# Altium project AML166-Core Rev.D.PrjPcb
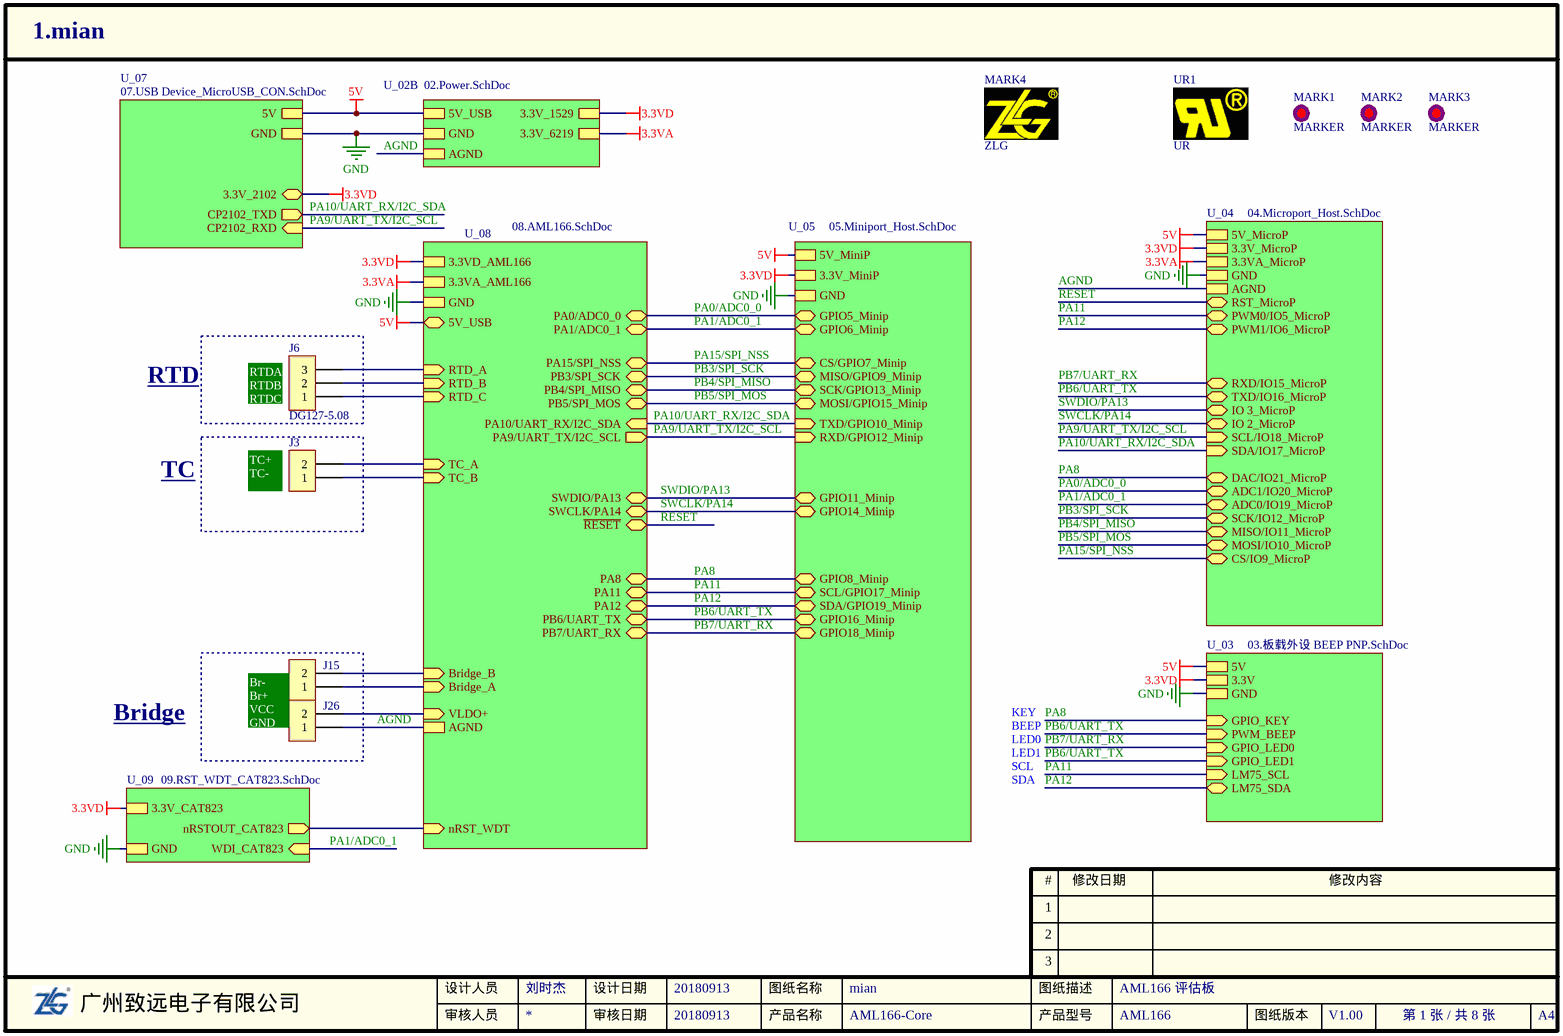
[diagram p0: 01.mian.SchDoc]
8 sheets, 138 parts. Net scope: hierarchical (ports join the sheet entries above them; power ports are global).
Sheets:
  01.mian.SchDoc
    U_08 = 08.AML166.SchDoc
    U_05 = 05.Miniport_Host.SchDoc
    U_04 = 04.Microport_Host.SchDoc
    U_03 = 03.板载外设 BEEP PNP.SchDoc
    U_02B = 02.Power.SchDoc
    U_09 = 09.RST_WDT_CAT823.SchDoc
    U_07 = 07.USB Device_MicroUSB_CON.SchDoc

## Sheet 01.mian.SchDoc
size A4; Author: 刘时杰; CompanyName: 广州致远电子有限公司; DocumentNumber: 1; SheetNumber: 1; SheetTotal: 8; PageSetup: Record=PageOptions|CenterHorizontal=True|CenterVertical=True|PrintScale=1.00|XCorrection=1.00|YCorrection=1.00|PrintKind=0|BorderSize=5000000|LeftOffset=0|BottomOffset=0|Orientation=2|PaperLength=1000|PaperWidth=1000|Scale=100|PaperSource=7|PrintQuality=600|MediaType=1|DitherType=10|PaperKind=A4|PrintScaleMode=1; DesignDate: 20180913; CheckDate: 20180913; SheetName: mian; SheetVersion: V1.00; SheetDescription: AML166 评估板; ProductName: AML166-Core; ProductModel: AML166

### Parts
J3  (no value)  [CON508P810W130D15S-2DIP]
J6  DG127-5.08  [CON508P1524L810W110D15S-3DIP]
J15  (no value)  [CON508P810W130D15S-2DIP]
J26  (no value)  [CON508P810W130D15S-2DIP]
MARK1  MARKER  [MARKER-C-1.0M]  (no BOM)
MARK2  MARKER  [MARKER-C-1.0M]  (no BOM)
MARK3  MARKER  [MARKER-C-1.0M]  (no BOM)
MARK4  ZLG  [ZLG0.7]  (no BOM)
UR1  UR  [ZY_UR-3X2]  (no BOM)

### Sub-sheets
U_02B = 02.Power.SchDoc: GND, 5V_USB, 3.3V_1529, 3.3V_6219, AGND
U_03 = 03.板载外设 BEEP PNP.SchDoc: GND, 3.3V, PWM_BEEP (in), GPIO_LED0 (in), GPIO_LED1 (in), 5V, LM75_SCL (in), LM75_SDA (bidir), GPIO_KEY (in)
U_04 = 04.Microport_Host.SchDoc: GND, 3.3V_MicroP, AGND, 5V_MicroP, 3.3VA_MicroP, RXD/IO15_MicroP (bidir), TXD/IO16_MicroP (bidir), MOSI/IO10_MicroP (bidir), SCK/IO12_MicroP (bidir), MISO/IO11_MicroP (bidir), IO 3_MicroP (bidir), IO 2_MicroP (bidir), PWM1/IO6_MicroP (bidir), PWM0/IO5_MicroP (bidir), SDA/IO17_MicroP (in), SCL/IO18_MicroP (in), ADC1/IO20_MicroP (bidir), ADC0/IO19_MicroP (bidir), DAC/IO21_MicroP (bidir), RST_MicroP (bidir), CS/IO9_MicroP (bidir)
U_05 = 05.Miniport_Host.SchDoc: GND, 3.3V_MiniP, 5V_MiniP, MISO/GPIO9_Minip (bidir), GPIO5_Minip (bidir), MOSI/GPIO15_Minip (bidir), SCK/GPIO13_Minip (bidir), GPIO11_Minip (bidir), CS/GPIO7_Minip (bidir), GPIO14_Minip (bidir), GPIO6_Minip (bidir), RXD/GPIO12_Minip (in), TXD/GPIO10_Minip (in), GPIO8_Minip (bidir), GPIO16_Minip (bidir), SDA/GPIO19_Minip (bidir), SCL/GPIO17_Minip (bidir), GPIO18_Minip (bidir)
U_07 = 07.USB Device_MicroUSB_CON.SchDoc: 5V, GND, CP2102_TXD (out), CP2102_RXD (in), 3.3V_2102
U_08 = 08.AML166.SchDoc: nRST_WDT (in), 3.3VD_AML166, PA10/UART_RX/I2C_SDA (in), PA15/SPI_NSS (bidir), PA0/ADC0_0 (bidir), PA1/ADC0_1 (bidir), PA9/UART_TX/I2C_SCL (out), PB3/SPI_SCK (bidir), PB5/SPI_MOS (bidir), PA11 (bidir), PA12 (bidir), PB7/UART_RX (bidir), PB4/SPI_MISO (bidir), PA8 (bidir), PB6/UART_TX (bidir), GND, RTD_A (in), RTD_B (in), RTD_C (in), TC_A (in), TC_B (in), AGND, SWDIO/PA13 (bidir), SWCLK/PA14 (bidir), ~{RESET} (bidir), 3.3VA_AML166, Bridge_A (in), Bridge_B (in), VLDO+ (in), 5V_USB
U_09 = 09.RST_WDT_CAT823.SchDoc: GND, 3.3V_CAT823, WDI_CAT823 (in), nRSTOUT_CAT823 (out)

### Nets
3.3VA: sheet U_08/3.3VA_AML166, sheet U_04/3.3VA_MicroP, sheet U_02B/3.3V_6219  [project net 3.3V_6219]
3.3VD: sheet U_08/3.3VD_AML166, sheet U_05/3.3V_MiniP, sheet U_04/3.3V_MicroP, sheet U_03/3.3V, sheet U_02B/3.3V_1529, sheet U_09/3.3V_CAT823, sheet U_07/3.3V_2102  [project net 3.3V]
5V: sheet U_08/5V_USB, sheet U_05/5V_MiniP, sheet U_04/5V_MicroP, sheet U_03/5V, sheet U_02B/5V_USB, sheet U_07/5V
AGND: J26.1 ; sheet U_08/GND, sheet U_08/AGND, sheet U_05/GND, sheet U_04/GND, sheet U_04/AGND, sheet U_03/GND, sheet U_02B/GND, sheet U_02B/AGND, sheet U_09/GND, sheet U_07/GND  [also labelled GND]
ADC1_0: J15.1 ; sheet U_08/Bridge_A
ADC1_1: J15.2 ; sheet U_08/Bridge_B
nRST_WDT: sheet U_08/nRST_WDT, sheet U_09/nRSTOUT_CAT823
PA0/ADC0_0: sheet U_08/PA0/ADC0_0, sheet U_05/GPIO5_Minip, sheet U_04/ADC1/IO20_MicroP  [project net ADC1/IO20_MicroP]
PA1/ADC0_1: sheet U_08/PA1/ADC0_1, sheet U_05/GPIO6_Minip, sheet U_04/ADC0/IO19_MicroP, sheet U_09/WDI_CAT823  [project net ADC0/IO19_MicroP]
PA8: sheet U_08/PA8, sheet U_05/GPIO8_Minip, sheet U_04/DAC/IO21_MicroP, sheet U_03/GPIO_KEY  [project net DAC/IO21_MicroP]
PA9/UART_TX/I2C_SCL: sheet U_08/PA9/UART_TX/I2C_SCL, sheet U_05/RXD/GPIO12_Minip, sheet U_04/SCL/IO18_MicroP, sheet U_07/CP2102_RXD
PA10/UART_RX/I2C_SDA: sheet U_08/PA10/UART_RX/I2C_SDA, sheet U_05/TXD/GPIO10_Minip, sheet U_04/SDA/IO17_MicroP, sheet U_07/CP2102_TXD
PA11: sheet U_08/PA11, sheet U_05/SCL/GPIO17_Minip, sheet U_04/PWM0/IO5_MicroP, sheet U_03/LM75_SCL  [project net LM75_SCL]
PA12: sheet U_08/PA12, sheet U_05/SDA/GPIO19_Minip, sheet U_04/PWM1/IO6_MicroP, sheet U_03/LM75_SDA  [project net LM75_SDA]
PA15/SPI_NSS: sheet U_08/PA15/SPI_NSS, sheet U_05/CS/GPIO7_Minip, sheet U_04/CS/IO9_MicroP  [project net CS/GPIO7_Minip]
PB3/SPI_SCK: sheet U_08/PB3/SPI_SCK, sheet U_05/MISO/GPIO9_Minip, sheet U_04/SCK/IO12_MicroP  [project net MISO/GPIO9_Minip]
PB4/SPI_MISO: sheet U_08/PB4/SPI_MISO, sheet U_05/SCK/GPIO13_Minip, sheet U_04/MISO/IO11_MicroP  [project net MISO/IO11_MicroP]
PB5/SPI_MOS: sheet U_08/PB5/SPI_MOS, sheet U_05/MOSI/GPIO15_Minip, sheet U_04/MOSI/IO10_MicroP  [project net MOSI/GPIO15_Minip]
PB6/UART_TX: sheet U_08/PB6/UART_TX, sheet U_05/GPIO16_Minip, sheet U_04/TXD/IO16_MicroP, sheet U_03/PWM_BEEP, sheet U_03/GPIO_LED1  [project net GPIO16_Minip]
PB7/UART_RX: sheet U_08/PB7/UART_RX, sheet U_05/GPIO18_Minip, sheet U_04/RXD/IO15_MicroP, sheet U_03/GPIO_LED0  [project net GPIO18_Minip]
~{RESET}: sheet U_08/~{RESET}, sheet U_04/RST_MicroP
RTD_A: J6.3 ; sheet U_08/RTD_A
RTD_B: J6.2 ; sheet U_08/RTD_B
RTD_C: J6.1 ; sheet U_08/RTD_C
SWCLK/PA14: sheet U_08/SWCLK/PA14, sheet U_05/GPIO14_Minip, sheet U_04/IO 2_MicroP  [project net GPIO14_Minip]
SWDIO/PA13: sheet U_08/SWDIO/PA13, sheet U_05/GPIO11_Minip, sheet U_04/IO 3_MicroP  [project net GPIO11_Minip]
TC_A: J3.2 ; sheet U_08/TC_A
TC_B: J3.1 ; sheet U_08/TC_B
VLDO: J26.2 ; sheet U_08/VLDO+

Not connected (* = marked no-connect by the designer): MARK1 0; MARK2 0; MARK3 0

### Notes on the sheet
- RTD
- (near J6) RTDA
  RTDB
  RTDC
- TC
- (near J3) TC+
  TC-
- KEY
- Bridge
- Br-
  Br+
  VCC
  GND
- BEEP
- LED0
- LED1
- SCL
- SDA
- 1
- #
- 修改日期
- 修改内容
- 2
- 3
- 设计人员
- 审核人员
- 设计日期
- 审核日期
- 产品名称
- 图纸名称
- 产品型号
- 图纸描述
- 图纸版本
- A4

### Library data of the parts
J3 J15 J26 = 1.10.06.0070: DG127-5.08-02P-14-00AH,180°,绿色,DEGSON,RoHS; 名称: 端子; 贴片和直插: THT; PCB备注: xhm-lq-wyy-150126; 器件优选方案: 正常状态，可以选用; 物料代码: 1.10.06.0070; 厂商: DEGSON; RoHS: RoHS; 型号: DG127-5.08-02P-14-00AH,180°,绿色; ComponentLink1Description: ErpDataInfo; ComponentLink1URL: http://erp.zlgmcu.com/ErpExt/ErpData/ListMateriel.aspx?pkey=1.10.06.0070
J6 = 19.04.00251: DG127-5.08-03P-14-00AH,180°,绿色,THT; 名称: 端子; PCB备注: 180925 yyf; 物料代码: 19.04.00251; Value: DG127-5.08; 型号: DG127-5.08-03P-14-00AH,180°,绿色,THT; 贴片和直插: THT; ComponentLink1Description: ErpDataInfo

## Sheet 08.AML166.SchDoc
size A3; CheckedBy: <审核人员>; Author: 刘时杰; DocumentNumber: 7; SheetNumber: 7; SheetTotal: 8; PageSetup: Record=PageOptions|CenterHorizontal=True|CenterVertical=True|PrintScale=1.00|XCorrection=1.00|YCorrection=1.00|PrintKind=0|BorderSize=5000000|LeftOffset=0|BottomOffset=0|Orientation=2|PaperLength=1000|PaperWidth=1000|Scale=100|PaperSource=7|PrintQuality=600|MediaType=1|DitherType=10|PaperKind=A4|PrintScaleMode=1; CheckDate: <审核日期>; SheetName: AML166_ADC24; SheetVersion: Rev.D; SheetDescription: AML166评估24位ADC性能电路; ProductName: AML166; ProductModel: AML166-Core
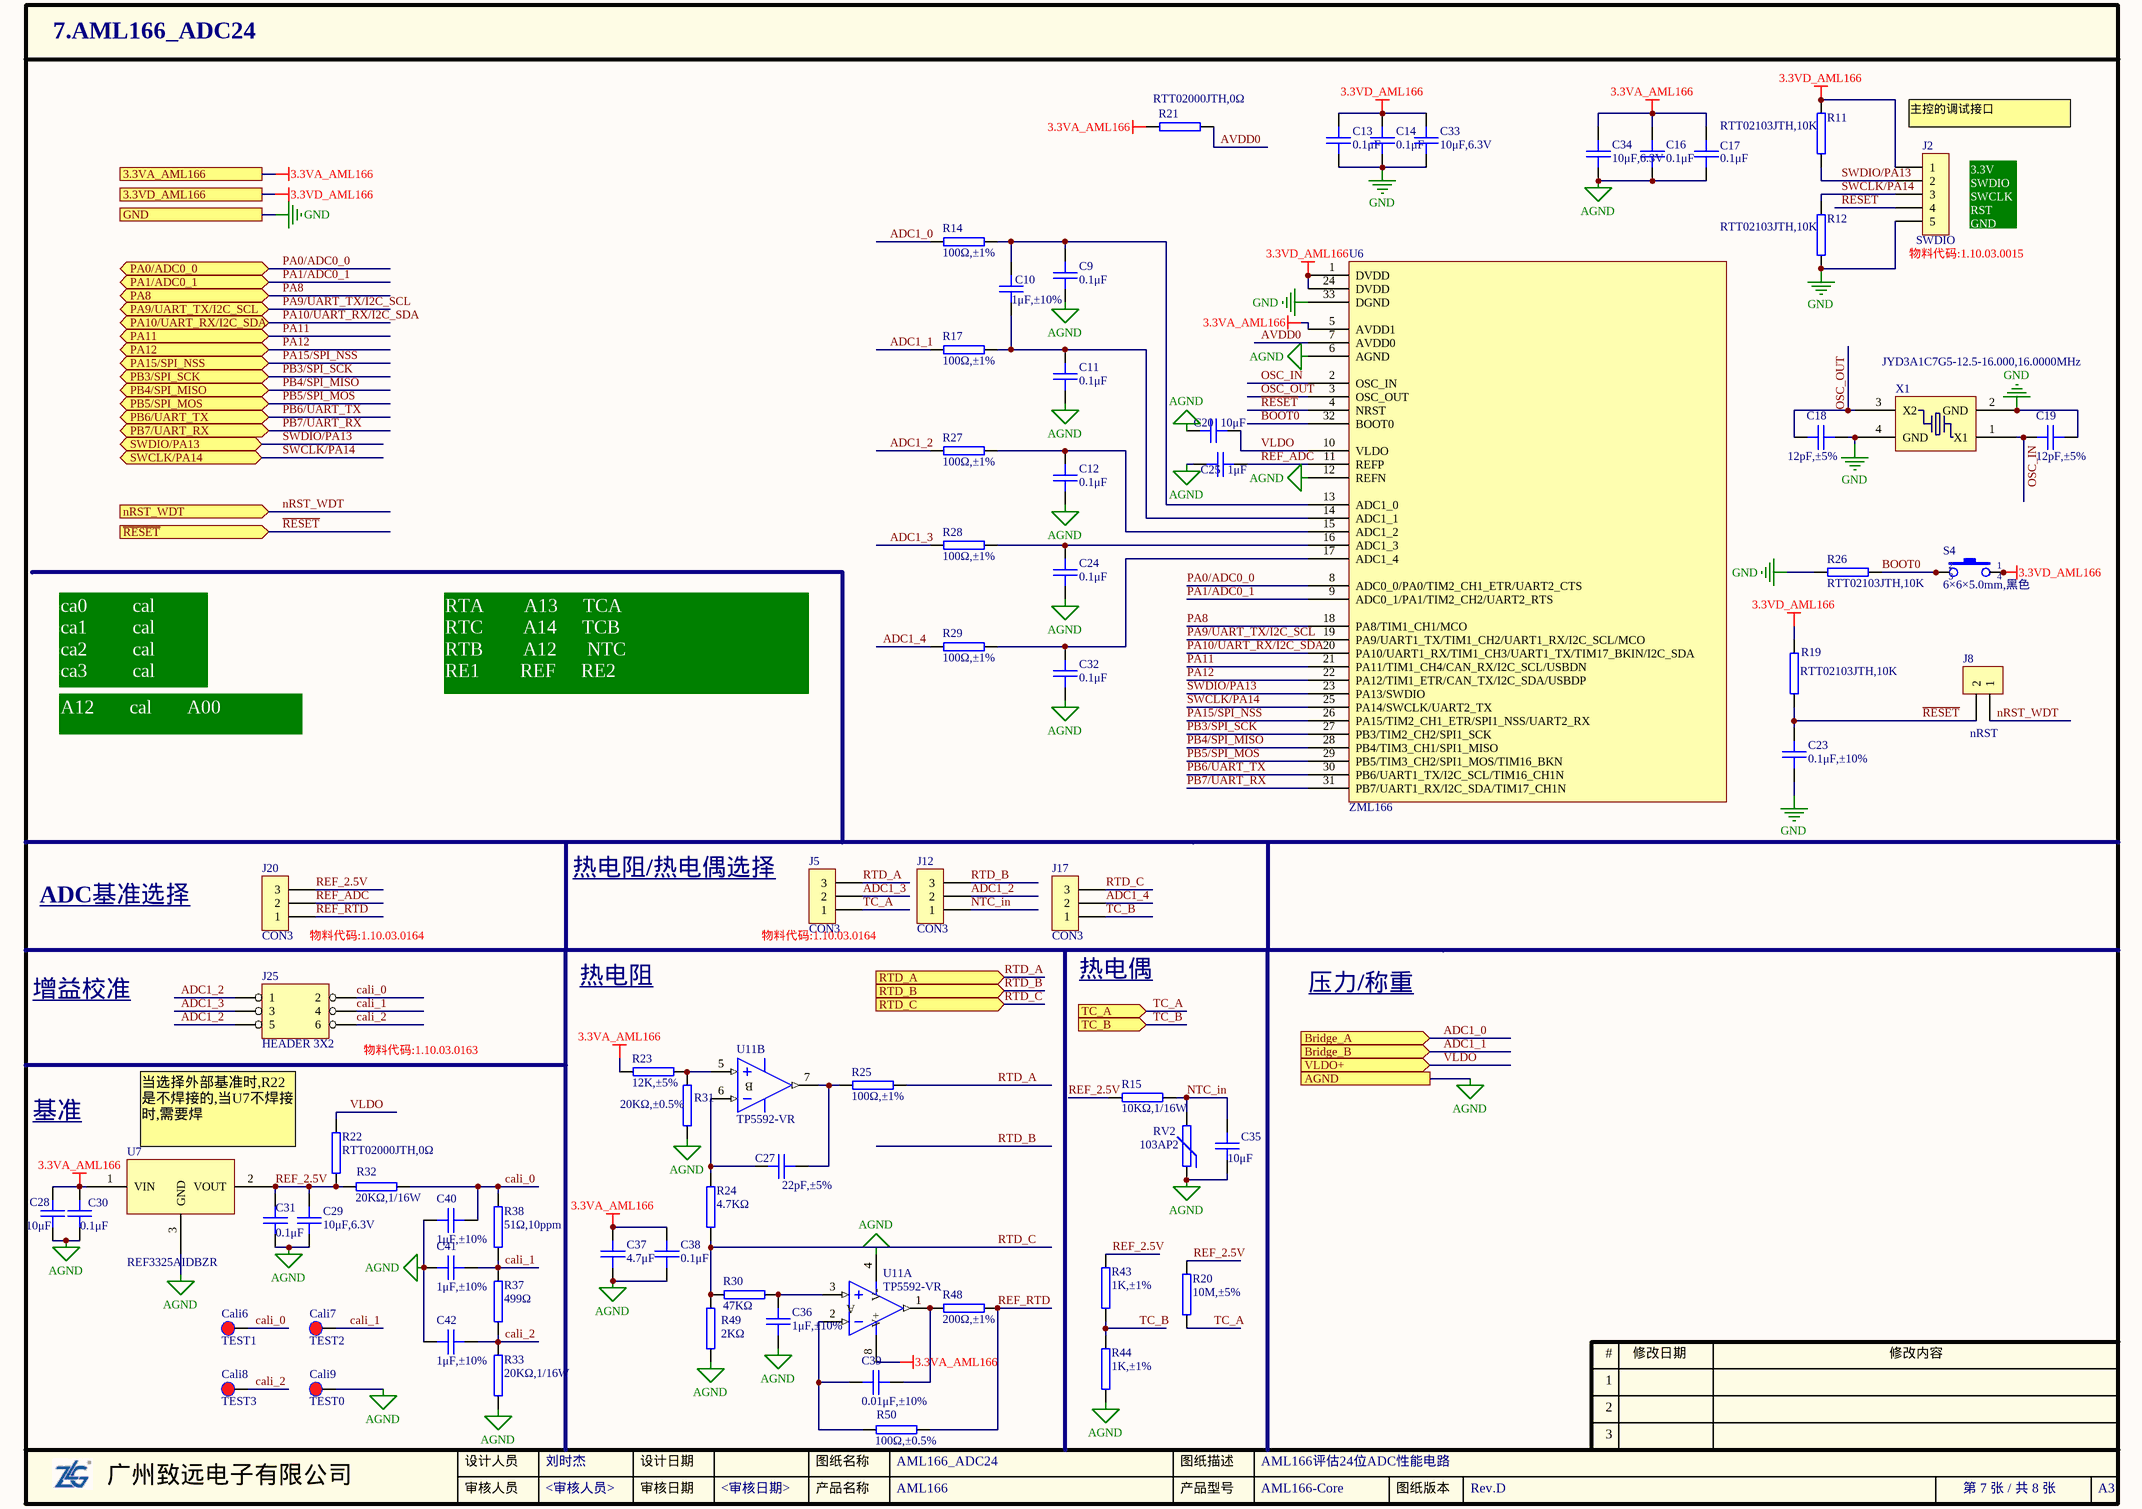
[diagram p1: 08.AML166.SchDoc]

### Parts
C9  0.1μF  [0402C]
C10  1μF,±10%  [0402C]
C11  0.1μF  [0402C]
C12  0.1μF  [0402C]
C13  0.1μF  [0402C]
C14  0.1μF  [0402C]
C16  0.1μF  [0402C]
C17  0.1μF  [0402C]
C18  12pF,±5%  [0402C]
C19  12pF,±5%  [0402C]
C20  10μF  [0603C]
C23  0.1μF,±10%  [0402C]
C24  0.1μF  [0402C]
C25  1μF  [0402C]
C27  22pF,±5%  [0402C]
C28  10μF  [0603C]
C29  10μF,6.3V  [0603C]
C30  0.1μF  [0402C]
C31  0.1μF  [0402C]
C32  0.1μF  [0402C]
C33  10μF,6.3V  [0603C]
C34  10μF,6.3V  [0603C]
C35  10μF  [0603C]
C36  1μF,±10%  [0402C]
C37  4.7μF  [0402C]
C38  0.1μF  [0402C]
C39  0.01μF,±10%  [0402C]
C40  1μF,±10%  [0402C]
C41  1μF,±10%  [0402C]
C42  1μF,±10%  [0402C]
Cali6  TEST1  [PAD-25/40]  (no BOM)
Cali7  TEST2  [PAD-25/40]  (no BOM)
Cali8  TEST3  [PAD-25/40]  (no BOM)
Cali9  TEST0  [PAD-25/40]  (no BOM)
J2  SWDIO  [SIP-5-2.54-6.0-R90]
J5  CON3  [SIP-3-2.54]
J8  nRST  [SIP-2-2.54]
J12  CON3  [SIP-3-2.54]
J17  CON3  [SIP-3-2.54]
J20  CON3  [SIP-3-2.54]
J25  HEADER 3X2  [IDC-6-2.54]
R11  RTT02103JTH,10K  [0402R]
R12  RTT02103JTH,10K  [0402R]
R14  100Ω,±1%  [0402R]
R15  10KΩ,1/16W  [0603R]
R17  100Ω,±1%  [0402R]
R19  RTT02103JTH,10K  [0402R]
R20  10M,±5%  [0402R]
R21  RTT02000JTH,0Ω  [0402R]
R22  RTT02000JTH,0Ω  [0402R]  (no BOM)
R23  12K,±5%  [0402R]
R24  4.7KΩ  [0603R]
R25  100Ω,±1%  [0402R]
R26  RTT02103JTH,10K  [0402R]
R27  100Ω,±1%  [0402R]
R28  100Ω,±1%  [0402R]
R29  100Ω,±1%  [0402R]
R30  47KΩ  [0603R]
R31  20KΩ,±0.5%  [0402R]
R32  20KΩ,1/16W  [0603R]
R33  20KΩ,1/16W  [0603R]
R37  499Ω  [0603R]
R38  51Ω,10ppm  [0603R]
R43  1K,±1%  [0402R]
R44  1K,±1%  [0402R]
R48  200Ω,±1%  [0402R]
R49  2KΩ  [0603R]
R50  100Ω,±0.5%  [0402R]
RV2  103AP2  [RESRR254W35L380T260H850P]
S4  value 6×6×5.0mm,黑色  [KEY-6S]  (hidden comment: SW-PB4P)
U6  ZML166  [QFN50P500X500X85-33N]
U7  REF3325AIDBZR  [SOT-23]
U11  TP5592-VR  [SOP65P490X120-8N]  (parts A,B of 2)
X1  JYD3A1C7G5-12.5-16.000,16.0000MHz  [OSCCC250X320X80-4N]

### Ports
3.3VA_AML166, 3.3VD_AML166, AGND, Bridge_A (in), Bridge_B (in), GND, nRST_WDT (in), PA0/ADC0_0 (bidir), PA1/ADC0_1 (bidir), PA8 (bidir), PA9/UART_TX/I2C_SCL (bidir), PA10/UART_RX/I2C_SDA (bidir), PA11 (bidir), PA12 (bidir), PA15/SPI_NSS (bidir), PB3/SPI_SCK (bidir), PB4/SPI_MISO (bidir), PB5/SPI_MOS (bidir), PB6/UART_TX (bidir), PB7/UART_RX (bidir), RTD_A (in), RTD_B (in), RTD_C (in), SWCLK/PA14 (bidir), SWDIO/PA13 (bidir), TC_A (in), TC_B (in), VLDO+ (in), ~{RESET} (in)

### Nets
3.3VA_AML166: C16.1 C17.1 C28.2 C30.1 C34.2 C37.1 C38.1 R21.1 R23.1 U6.5(AVDD1) U7.1(VIN) U11.8(V+) ; port 3.3VA_AML166  [project net 3.3V_6219]
3.3VD_AML166: C13.1 C14.1 C33.2 J2.1 R11.2 R19.1 S4.1 S4.4 U6.1(DVDD) U6.24(DVDD) ; port 3.3VD_AML166  [project net 3.3V]
AGND: C9.2 C11.2 C12.2 C13.2 C14.2 C16.2 C17.2 C18.1 C19.2 C20.2 C23.2 C24.2 C25.1 C28.1 C29.1 C30.2 C31.2 C32.2 C33.1 C34.1 C35.1 C36.2 C37.2 C38.2 C40.1 C41.1 C42.1 Cali9.1 J2.5 R12.1 R26.2 R31.1 R33.2 R44.2 R49.1 RV2.1 U6.6(AGND) U6.12(REFN) U6.33(DGND) U7.3(GND) U11.4(V-) X1.2(GND) X1.4(GND) ; port GND, port AGND  [also labelled GND]
ADC1_0: R14.1 ; port Bridge_A
ADC1_1: R17.1 ; port Bridge_B
ADC1_2: J12.2 J25.1 J25.5 R27.1
ADC1_3: J5.2 J25.3 R28.1
ADC1_4: J17.2 R29.1
AVDD0: R21.2 U6.7(AVDD0)
BOOT0: R26.1 S4.2 S4.3 U6.32(BOOT0)
cali_0: C40.2 Cali6.1 J25.2 R32.1 R38.1
cali_1: C41.2 Cali7.1 J25.4 R37.2 R38.2
cali_2: C42.2 Cali8.1 J25.6 R33.1 R37.1
nRST_WDT: J8.1 ; port nRST_WDT
NTC_in: C35.2 J12.1 R15.2 RV2.2
OSC_IN: C19.1 U6.2(OSC_IN) X1.1(X1)
OSC_OUT: C18.2 U6.3(OSC_OUT) X1.3(X2)
PA0/ADC0_0: U6.8(ADC0_0/PA0/TIM2_CH1_ETR/UART2_CTS) ; port PA0/ADC0_0  [project net ADC1/IO20_MicroP]
PA1/ADC0_1: U6.9(ADC0_1/PA1/TIM2_CH2/UART2_RTS) ; port PA1/ADC0_1  [project net ADC0/IO19_MicroP]
PA8: U6.18(PA8/TIM1_CH1/MCO) ; port PA8  [project net DAC/IO21_MicroP]
PA9/UART_TX/I2C_SCL: U6.19(PA9/UART1_TX/TIM1_CH2/UART1_RX/I2C_SCL/MCO) ; port PA9/UART_TX/I2C_SCL
PA10/UART_RX/I2C_SDA: U6.20(PA10/UART1_RX/TIM1_CH3/UART1_TX/TIM17_BKIN/I2C_SDA) ; port PA10/UART_RX/I2C_SDA
PA11: U6.21(PA11/TIM1_CH4/CAN_RX/I2C_SCL/USBDN) ; port PA11  [project net LM75_SCL]
PA12: U6.22(PA12/TIM1_ETR/CAN_TX/I2C_SDA/USBDP) ; port PA12  [project net LM75_SDA]
PA15/SPI_NSS: U6.26(PA15/TIM2_CH1_ETR/SPI1_NSS/UART2_RX) ; port PA15/SPI_NSS  [project net CS/GPIO7_Minip]
PB3/SPI_SCK: U6.27(PB3/TIM2_CH2/SPI1_SCK) ; port PB3/SPI_SCK  [project net MISO/GPIO9_Minip]
PB4/SPI_MISO: U6.28(PB4/TIM3_CH1/SPI1_MISO) ; port PB4/SPI_MISO  [project net MISO/IO11_MicroP]
PB5/SPI_MOS: U6.29(PB5/TIM3_CH2/SPI1_MOS/TIM16_BKN) ; port PB5/SPI_MOS  [project net MOSI/GPIO15_Minip]
PB6/UART_TX: U6.30(PB6/UART1_TX/I2C_SCL/TIM16_CH1N) ; port PB6/UART_TX  [project net GPIO16_Minip]
PB7/UART_RX: U6.31(PB7/UART1_RX/I2C_SDA/TIM17_CH1N) ; port PB7/UART_RX  [project net GPIO18_Minip]
~{RESET}: C23.1 J2.4 J8.2 R19.2 U6.4(NRST) ; port ~{RESET}
REF_2.5V: C29.2 C31.1 J20.3 R15.1 R20.2 R22.1 R32.2 R43.2 U7.2(VOUT)
REF_ADC: C25.2 J20.2 U6.11(REFP)
REF_RTD: J20.1 R48.2 R50.1
RTD_A: J5.3 R25.2 ; port RTD_A
RTD_B: J12.3 ; port RTD_B
RTD_C: J17.3 R24.1 R30.1 R49.2 ; port RTD_C
SWCLK/PA14: J2.3 R12.2 U6.25(PA14/SWCLK/UART2_TX) ; port SWCLK/PA14  [project net GPIO14_Minip]
SWDIO/PA13: J2.2 R11.1 U6.23(PA13/SWDIO) ; port SWDIO/PA13  [project net GPIO11_Minip]
TC_A: J5.1 R20.1 ; port TC_A
TC_B: J17.1 R43.1 R44.1 ; port TC_B
VLDO: C20.1 R22.2 U6.10(VLDO) ; port VLDO+
NetC9_1: C9.1 C10.1 R14.2 U6.13(ADC1_0)
NetC10_2: C10.2 C11.1 R17.2 U6.14(ADC1_1)
NetC12_1: C12.1 R27.2 U6.15(ADC1_2)
NetC24_1: C24.1 R28.2 U6.16(ADC1_3)
NetC27_1: C27.1 R24.2 U11.6(IN-)
NetC27_2: C27.2 R25.1 U11.7(OUT)
NetC32_1: C32.1 R29.2 U6.17(ADC1_4)
NetC36_1: C36.1 R30.2 U11.3(IN+)
NetC39_1: C39.1 R50.2 U11.2(IN-)
NetC39_2: C39.2 R48.1 U11.1(OUT)
NetR23_2: R23.2 R31.2 U11.5(IN+)

### Notes on the sheet
- (near J2) 主控的调试接口
- (near J2) 3.3V
  SWDIO
  SWCLK
  RST
  GND
- (near J2) 物料代码:1.10.03.0015
- ca0         cal
  ca1         cal
  ca2         cal
  ca3         cal
- RTA        A13     TCA
  RTC        A14     TCB
  RTB        A12      NTC
  RE1        REF     RE2
- A12       cal       A00
- ADC基准选择
- 热电阻/热电偶选择
- (near J20) 物料代码:1.10.03.0164
- 热电阻
- (near J5) 物料代码:1.10.03.0164
- (near J17) 热电偶
- 压力/称重
- 增益校准
- (near J25) 物料代码:1.10.03.0163
- 基准
- 当选择外部基准时,R22是不焊接的,当U7不焊接时,需要焊
- 1
- #
- 修改日期
- 修改内容
- 2
- 3
- 广州致远电子有限公司
- 设计人员
- 审核人员
- 设计日期
- 审核日期
- 产品名称
- 图纸名称
- 产品型号
- 图纸描述
- 图纸版本
- A3
- (in symbol 1.05.20.0102, part A) A
- (in symbol 1.05.20.0102, part B) B

### Library data of the parts
C9 C11-C14 C16 C17 C24 C30-C32 C38 = 1.02.17.0118: GCM155R71E104KE02D,0.1μF,±10%,25V,X7R,0402,muRata,RoHS; 名称: 电容; 封装: 0402; 贴片和直插: SMT; PCB备注: 161012yjh; 器件优选方案: 正常状态，可以选用; 物料代码: 1.02.17.0118; Value: 0.1μF; 厂商: muRata; RoHS: RoHS; 型号: GCM155R71E104KE02D,0.1μF,±10%,25V,X7R; ComponentLink1Description: ErpDataInfo; ComponentLink1URL: http://erp.zlgmcu.com/ErpExt/ErpData/ListMateriel.aspx?pkey=1.02.17.0118
C10 C25 C36 C40-C42 = 1.02.17.0092: GRM155R61C105KA12D,1μF,±10% ,16V,X5R,0402,muRata,RoHS; 名称: 电容; 封装: 0402; 贴片和直插: SMT; PCB备注: 无数据手册，依据采购部提供的信息添加的封装。; 器件优选方案: 正常状态，可以选用; 物料代码: 1.02.17.0092; 厂商: muRata; RoHS: RoHS; 型号: 1μF,±10% ,16V,X5R; ComponentLink1Description: ErpDataInfo; ComponentLink1URL: http://erp.zlgmcu.com/ErpExt/ErpData/ListMateriel.aspx?pkey=1.02.17.0092
  C10 C36 C40-C42: Value: 1μF,±10%
  C25: Value: 1μF
C18 C19 = 1.02.17.0018: GRM1555C1H120JA01D,12pF,±5%,50V,C0G,0402,muRata,RoHS; 名称: 电容; 封装: 0402; 设备封装名称: C0402_12PF_COG_50V_5%; 贴片和直插: SMT; 器件优选方案: 正常状态，可以选用; 物料代码: 1.02.17.0018; Value: 12pF,±5%; 厂商: muRata; RoHS: RoHS; 型号: 12pF,±5%,50V,C0G; ComponentLink1Description: ErpDataInfo; ComponentLink1URL: http://erp.zlgmcu.com/ErpExt/ErpData/ListMateriel.aspx?pkey=1.02.17.0018
C20 C28 C29 C33-C35 = 1.02.01.0065: 10μF,6.3V,X5R,GRM188R60J106M****,0603,Murata,RoHS; 名称: 电容; 封装: 0603; 贴片和直插: SMT; 器件优选方案: 正常状态，可以选用; 物料代码: 1.02.01.0065; 厂商: muRata; RoHS: RoHS; 型号: 10μF,6.3V,X5R,GRM188R60J106M****; ComponentLink1Description: ErpDataInfo; ComponentLink1URL: http://erp.zlgmcu.com/ErpExt/ErpData/ListMateriel.aspx?pkey=1.02.01.0065
  C20 C28 C35: Value: 10μF
  C29 C33 C34: Value: 10μF,6.3V
C23 = 1.02.17.0006: GRM155R71C104KA88D,0.1μF,±10%,16V,X7R,0402,muRata,RoHS; 名称: 电容; 封装: 0402; 设备封装名称: C0402_0.1uF_X7R_16V_10%; 贴片和直插: SMT; 器件优选方案: 正常状态，可以选用; 物料代码: 1.02.17.0006; Value: 0.1μF,±10%; 厂商: muRata; RoHS: RoHS; 型号: 0.1μF,±10%,16V,X7R; ComponentLink1Description: ErpDataInfo; ComponentLink1URL: http://erp.zlgmcu.com/ErpExt/ErpData/ListMateriel.aspx?pkey=1.02.17.0006
C27 = 1.02.17.0036: GRM1555C1H220JA01D,22pF,±5%,50V,C0G,0402,muRata,RoHS; 名称: 电容; 封装: 0402; 设备封装名称: C0402_22PF_NPO_50V_5%; 贴片和直插: SMT; 器件优选方案: 正常状态，可以选用; 物料代码: 1.02.17.0036; Value: 22pF,±5%; 厂商: muRata; RoHS: RoHS; 型号: 22pF,±5%,50V,C0G; ComponentLink1Description: ErpDataInfo; ComponentLink1URL: http://erp.zlgmcu.com/ErpExt/ErpData/ListMateriel.aspx?pkey=1.02.17.0036
C37 = 1.02.17.0073: GRM155R60J475ME87D,4.7μF,±20%,6.3V,X5R,0402,muRata,RoHS; 名称: 电容; 封装: 0402; 贴片和直插: SMT; 器件优选方案: 正常状态，可以选用; 物料代码: 1.02.17.0073; Value: 4.7μF; 厂商: muRata; RoHS: RoHS; 型号: 4.7μF,±20%,6.3V,X5R; ComponentLink1Description: ErpDataInfo; ComponentLink1URL: http://erp.zlgmcu.com/ErpExt/ErpData/ListMateriel.aspx?pkey=1.02.17.0073
C39 = 1.02.17.0019: GRM155R71H103KA88D,0.01μF,±10%,50V,X7R,0402,muRata,RoHS; 名称: 电容; 封装: 0402; 设备封装名称: C0402_0.01uF_X7R_50V_10%; 贴片和直插: SMT; 器件优选方案: 正常状态，可以选用; 物料代码: 1.02.17.0019; Value: 0.01μF,±10%; 厂商: muRata; RoHS: RoHS; 型号: 0.01μF,±10%,50V,X7R; ComponentLink1Description: ErpDataInfo; ComponentLink1URL: http://erp.zlgmcu.com/ErpExt/ErpData/ListMateriel.aspx?pkey=1.02.17.0019
Cali6-Cali9 = TEST-DOT
J2 = CON5: Connector; 物料代码: 1.10.03.0015
J5 J12 J17 J20 = CON3: Connector
J8 = CON2: Connector; 物料代码: 1.10.03.0164
R11 R12 R19 R26 = 1.01.17.0006: RTT02103JTH,10K,±5%,0402,RALEC,RoHS; 名称: 电阻; 封装: 0402; 设备封装名称: R0402_10K; 贴片和直插: SMT; 器件优选方案: 正常状态，可以选用; 物料代码: 1.01.17.0006; Value: RTT02103JTH,10K; 厂商: RALEC; RoHS: RoHS; 型号: RTT02103JTH,10K,±5%; ComponentLink1Description: ErpDataInfo; ComponentLink1URL: http://erp.zlgmcu.com/ErpExt/ErpData/ListMateriel.aspx?pkey=1.01.17.0006
R14 R17 R25 R27-R29 = 1.01.17.0029: 100Ω,±1%,0402,RALEC,RoHS; 名称: 电阻; 封装: 0402; 设备封装名称: R0402_100R_1%; 贴片和直插: SMT; 器件优选方案: 正常状态，可以选用; 物料代码: 1.01.17.0029; Value: 100Ω,±1%; 厂商: Ralec; RoHS: RoHS; 型号: 100Ω,±1%; ComponentLink1Description: ErpDataInfo; ComponentLink1URL: http://erp.zlgmcu.com/ErpExt/ErpData/ListMateriel.aspx?pkey=1.01.17.0029
R15 = 1.01.01.0192: 10KΩ,1/16W,10PPM/℃,±0.1%,0603,Viking,RoHS; 名称: 电阻; 封装: 0603; 设备封装名称: R0603_10K_0.1%; 贴片和直插: SMT; 器件优选方案: 临时/偏门物料/不主推物料，谨慎选用; 物料代码: 1.01.01.0192; Value: 10KΩ,1/16W; 厂商: Viking; RoHS: RoHS; 型号: 10KΩ,1/16W,10PPM/℃,±0.1%; ComponentLink1Description: ErpDataInfo; ComponentLink1URL: http://erp.zlgmcu.com/ErpExt/ErpData/ListMateriel.aspx?pkey=1.01.01.0192
R20 = 1.01.17.0005: 10M,±5%,0402,RALEC,RoHS; 名称: 电阻; 封装: 0402; 设备封装名称: R0402_10M; 贴片和直插: SMT; 器件优选方案: 正常状态，可以选用; 物料代码: 1.01.17.0005; Value: 10M,±5%; 厂商: Ralec; RoHS: RoHS; 型号: 10M,±5%; ComponentLink1Description: ErpDataInfo; ComponentLink1URL: http://erp.zlgmcu.com/ErpExt/ErpData/ListMateriel.aspx?pkey=1.01.17.0005
R21 R22 = 1.01.17.0004: RTT02000JTH,0Ω,±5%,0402,RALEC,RoHS; 名称: 电阻; 封装: 0402; 设备封装名称: R0402_0R; 贴片和直插: SMT; 器件优选方案: 正常状态，可以选用; 物料代码: 1.01.17.0004; Value: RTT02000JTH,0Ω; 厂商: RALEC; RoHS: RoHS; 型号: RTT02000JTH,0Ω,±5%; ComponentLink1Description: ErpDataInfo; ComponentLink1URL: http://erp.zlgmcu.com/ErpExt/ErpData/ListMateriel.aspx?pkey=1.01.17.0004
R23 = 1.01.17.0035: 12K,±5%,0402,RALEC,RoHS; 名称: 电阻; 封装: 0402; 设备封装名称: R0402_12K; 贴片和直插: SMT; 器件优选方案: 正常状态，可以选用; 物料代码: 1.01.17.0035; Value: 12K,±5%; 厂商: Ralec; RoHS: RoHS; 型号: 12K,±5%; ComponentLink1Description: ErpDataInfo; ComponentLink1URL: http://erp.zlgmcu.com/ErpExt/ErpData/ListMateriel.aspx?pkey=1.01.17.0035
R24 = 1.01.01.0045: 4.7KΩ,0603,*,RoHS; 名称: 电阻; 封装: 0603; 设备封装名称: R0603_4.7K; 厂商: Ralec; 贴片和直插: SMT; 器件优选方案: 正常状态，可以选用; 物料代码: 1.01.01.0045; Value: 4.7KΩ; RoHS: RoHS; 型号: 4.7KΩ; ComponentLink1Description: ErpDataInfo; ComponentLink1URL: http://erp.zlgmcu.com/ErpExt/ErpData/ListMateriel.aspx?pkey=1.01.01.0045
R30 = 1.01.01.0060: 47KΩ,0603,*,RoHS; 名称: 电阻; 封装: 0603; 设备封装名称: R0603_47K; 厂商: Ralec; 贴片和直插: SMT; 器件优选方案: 正常状态，可以选用; 物料代码: 1.01.01.0060; Value: 47KΩ; RoHS: RoHS; 型号: 47KΩ; ComponentLink1Description: ErpDataInfo; ComponentLink1URL: http://erp.zlgmcu.com/ErpExt/ErpData/ListMateriel.aspx?pkey=1.01.01.0060
R31 = 1.01.17.0053: 20KΩ,±0.5%,0402,RoHS; 名称: 电阻; 封装: 0402; 设备封装名称: R0402_20K_0.5%; 厂商: Ralec; 贴片和直插: SMT; 器件优选方案: 正常状态，可以选用; 物料代码: 1.01.17.0053; Value: 20KΩ,±0.5%; RoHS: RoHS; 型号: 20KΩ,±0.5%; ComponentLink1Description: ErpDataInfo; ComponentLink1URL: http://erp.zlgmcu.com/ErpExt/ErpData/ListMateriel.aspx?pkey=1.01.17.0053
R32 R33 = 1.01.01.0207: 20KΩ,1/16W,10PPM/℃,±0.1%,0603,Viking,RoHS; 名称: 电阻; 封装: 0603; 贴片和直插: SMT; 器件优选方案: 临时/偏门物料/不主推物料，谨慎选用; 物料代码: 1.01.01.0207; Value: 20KΩ,1/16W; 厂商: Viking; RoHS: RoHS; 型号: 20KΩ,1/16W,10PPM/℃,±0.1%; ComponentLink1Description: ErpDataInfo; ComponentLink1URL: http://erp.zlgmcu.com/ErpExt/ErpData/ListMateriel.aspx?pkey=1.01.01.0207
R37 = 1.01.01.0155: 499Ω,RN731JTTD,4990B10,0603,KOA,RoHS; 名称: 电阻; 封装: 0603; 设备封装名称: R0603_499R_0.1%; 贴片和直插: SMT; 器件优选方案: 临时/偏门物料/不主推物料，谨慎选用; 物料代码: 1.01.01.0155; Value: 499Ω; 厂商: KOA; RoHS: RoHS; 型号: 499Ω,RN731JTTD,4990B10; ComponentLink1Description: ErpDataInfo; ComponentLink1URL: http://erp.zlgmcu.com/ErpExt/ErpData/ListMateriel.aspx?pkey=1.01.01.0155
R38 = 1.01.01.0215: 51Ω,10ppm,±0.1%,AR03BTB0510,0603,Viking,RoHS; 名称: 电阻; 封装: 0603; 贴片和直插: SMT; 器件优选方案: 临时/偏门物料/不主推物料，谨慎选用; 物料代码: 1.01.01.0215; Value: 51Ω,10ppm; 厂商: Viking; RoHS: RoHS; 型号: 51Ω,10ppm,±0.1%,AR03BTB0510; ComponentLink1Description: ErpDataInfo; ComponentLink1URL: http://erp.zlgmcu.com/ErpExt/ErpData/ListMateriel.aspx?pkey=1.01.01.0215
R43 R44 = 1.01.17.0016: 1K,±1%,0402,RALEC,RoHS; 名称: 电阻; 封装: 0402; 设备封装名称: R0402_1K_1%; 贴片和直插: SMT; 器件优选方案: 正常状态，可以选用; 物料代码: 1.01.17.0016; Value: 1K,±1%; 厂商: Ralec; RoHS: RoHS; 型号: 1K,±1%; ComponentLink1Description: ErpDataInfo; ComponentLink1URL: http://erp.zlgmcu.com/ErpExt/ErpData/ListMateriel.aspx?pkey=1.01.17.0016
R48 = 1.01.17.0073: 200Ω,±1%,0402,RoHS; 名称: 电阻; 封装: 0402; 设备封装名称: R0402_200R_1%; 厂商: Ralec; 贴片和直插: SMT; 器件优选方案: 正常状态，可以选用; 物料代码: 1.01.17.0073; Value: 200Ω,±1%; RoHS: RoHS; 型号: 200Ω,±1%; ComponentLink1Description: ErpDataInfo; ComponentLink1URL: http://erp.zlgmcu.com/ErpExt/ErpData/ListMateriel.aspx?pkey=1.01.17.0073
R49 = 1.01.01.0157: 2KΩ,RN731JTTD,2001B10,0603,KOA,RoHS; 名称: 电阻; 封装: 0603; 设备封装名称: R0603_2K_0.1%; 贴片和直插: SMT; 器件优选方案: 临时/偏门物料/不主推物料，谨慎选用; 物料代码: 1.01.01.0157; Value: 2KΩ; 厂商: KOA; RoHS: RoHS; 型号: 2KΩ,RN731JTTD,2001B10; ComponentLink1Description: ErpDataInfo; ComponentLink1URL: http://erp.zlgmcu.com/ErpExt/ErpData/ListMateriel.aspx?pkey=1.01.01.0157
R50 = 1.01.17.0052: 100Ω,±0.5%,0402,RoHS; 名称: 电阻; 封装: 0402; 设备封装名称: R0402_100R_0.5%; 厂商: Ralec; 贴片和直插: SMT; 器件优选方案: 正常状态，可以选用; 物料代码: 1.01.17.0052; Value: 100Ω,±0.5%; RoHS: RoHS; 型号: 100Ω,±0.5%; ComponentLink1Description: ErpDataInfo; ComponentLink1URL: http://erp.zlgmcu.com/ErpExt/ErpData/ListMateriel.aspx?pkey=1.01.17.0052
RV2 = 1.01.14.0020: 103AP2,SIP,semitec,RoHS; 名称: 热敏电阻(临时); 贴片和直插: THT; PCB备注: 171205CZY; 器件优选方案: 临时/偏门物料/不主推物料，谨慎选用; 物料代码: 1.01.14.0020; Value: 103AP2; 封装: SIP; 厂商: semitec; RoHS: RoHS; 型号: 103AP2; ComponentLink1Description: ErpDataInfo; ComponentLink1URL: http://erp.zlgmcu.com/ErpExt/ErpData/ListMateriel.aspx?pkey=1.01.14.0020
S4 = 1.09.01.0003: 6×6×5.0mm,黑色,SMD,,*; 名称: 轻触按键; 贴片和直插: SMT; 物料代码: 1.09.01.0003; 型号: 6×6×5.0mm,黑色,SMD; ComponentLink1Description: ErpDataInfo; ComponentLink1URL: http://erp.zlgmcu.com/ErpExt/ErpData/ListMateriel.aspx?pkey=1.09.01.0003
U7 = 1.05.10.0334: REF3325AIDBZR,SOT-23,TI; 名称: 集成电路; 设备封装名称: SOT-23_REF3325AIDBZR; 贴片和直插: SMT; 器件优选方案: 量产物料,优先选用; 物料代码: 1.05.10.0334; Value: REF3325AIDBZR; 封装: SOT-23; 厂商: TI; 型号: REF3325AIDBZR; ComponentLink1Description: ErpDataInfo; ComponentLink1URL: http://erp.zlgmcu.com/ErpExt/ErpData/ListMateriel.aspx?pkey=1.05.10.0334
U11 = 1.05.20.0102: TP5592-VR,MSOP-8,3PEAK,RoHS; 名称: 集成电路(临时); 贴片和直插: SMT; PCB备注: 170810lmd; 器件优选方案: 临时/偏门物料/不主推物料，谨慎选用; 物料代码: 1.05.20.0102; Value: TP5592-VR; 封装: MSOP-8; 厂商: 3PEAK; RoHS: RoHS; 型号: TP5592-VR; ComponentLink1Description: ErpDataInfo; ComponentLink1URL: http://erp.zlgmcu.com/ErpExt/ErpData/ListMateriel.aspx?pkey=1.05.20.0102
X1 = 1.07.03.0077: JYD3A1C7G5-12.5-16.000,16.0000MHz,±10ppm,12.5pF,-40~85℃,SMD3225,JYEG,RoHS; 名称: 晶体; 贴片和直插: SMT; PCB备注: 151225lmd171128ZW; 器件优选方案: 正常状态，可以选用; 物料代码: 1.07.03.0077; Value: JYD3A1C7G5-12.5-16.000,16.0000MHz; 封装: SMD3225; 厂商: JYEG; RoHS: RoHS; 型号: JYD3A1C7G5-12.5-16.000,16.0000MHz,±10ppm,12.5pF,-40~85℃; ComponentLink1Description: ErpDataInfo; ComponentLink1URL: http://erp.zlgmcu.com/ErpExt/ErpData/ListMateriel.aspx?pkey=1.07.03.0077

## Sheet 05.Miniport_Host.SchDoc
size A4; CheckedBy: <审核日期>; Author: 刘时杰; CompanyName: 广州致远电子有限公司; DocumentNumber: 5; SheetNumber: 5; SheetTotal: 8; PageSetup: Record=PageOptions|CenterHorizontal=True|CenterVertical=True|PrintScale=1.00|XCorrection=1.00|YCorrection=1.00|PrintKind=0|BorderSize=5000000|LeftOffset=0|BottomOffset=0|Orientation=2|PaperLength=1000|PaperWidth=1000|Scale=100|PaperSource=7|PrintQuality=600|MediaType=1|DitherType=10|PaperKind=A4|PrintScaleMode=1; DesignDate: 20180913; CheckDate: <审核人员>; SheetName: MiniPort接口; SheetVersion: V1.01; SheetDescription: MiniPort接口; productModel: AML166-Core; productName: AML166评估板
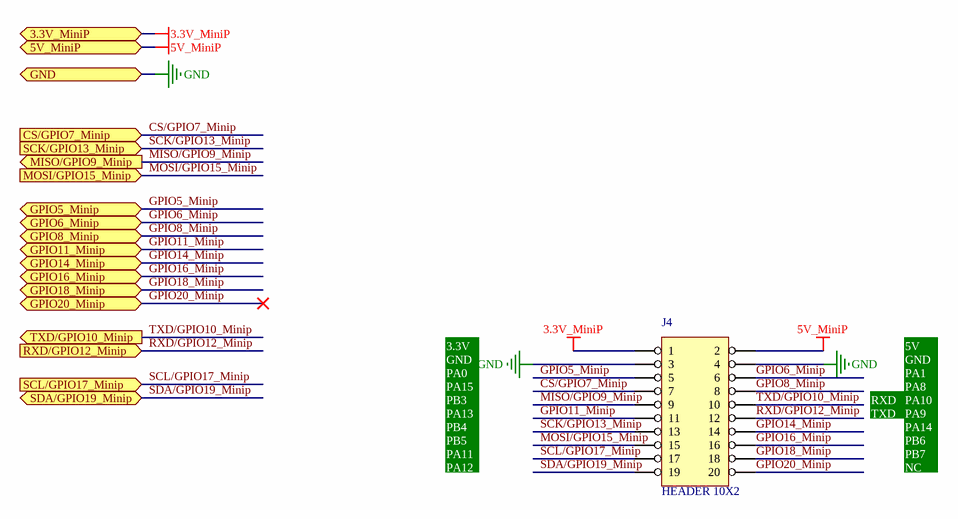
[diagram p2: 05.Miniport_Host.SchDoc]

### Parts
J4  HEADER 10X2  [IDC-20-2.54-R90]

### Ports
3.3V_MiniP, 5V_MiniP, CS/GPIO7_Minip (in), GND, GPIO5_Minip (bidir), GPIO6_Minip (bidir), GPIO8_Minip (bidir), GPIO11_Minip (bidir), GPIO14_Minip (bidir), GPIO16_Minip (bidir), GPIO18_Minip (bidir), GPIO20_Minip (bidir), MISO/GPIO9_Minip (out), MOSI/GPIO15_Minip (in), RXD/GPIO12_Minip (in), SCK/GPIO13_Minip (in), SCL/GPIO17_Minip (in), SDA/GPIO19_Minip (bidir), TXD/GPIO10_Minip (out)

### Nets
3.3V_MiniP: J4.1 ; port 3.3V_MiniP  [project net 3.3V]
5V_MiniP: J4.2 ; port 5V_MiniP  [project net 5V]
GND: J4.3 J4.4 ; port GND  [project net AGND]
CS/GPIO7_Minip: J4.7 ; port CS/GPIO7_Minip
GPIO5_Minip: J4.5 ; port GPIO5_Minip  [project net ADC1/IO20_MicroP]
GPIO6_Minip: J4.6 ; port GPIO6_Minip  [project net ADC0/IO19_MicroP]
GPIO8_Minip: J4.8 ; port GPIO8_Minip  [project net DAC/IO21_MicroP]
GPIO11_Minip: J4.11 ; port GPIO11_Minip
GPIO14_Minip: J4.14 ; port GPIO14_Minip
GPIO16_Minip: J4.16 ; port GPIO16_Minip
GPIO18_Minip: J4.18 ; port GPIO18_Minip
GPIO20_Minip: J4.20 ; port GPIO20_Minip
MISO/GPIO9_Minip: J4.9 ; port MISO/GPIO9_Minip
MOSI/GPIO15_Minip: J4.15 ; port MOSI/GPIO15_Minip
RXD/GPIO12_Minip: J4.12 ; port RXD/GPIO12_Minip  [project net PA9/UART_TX/I2C_SCL]
SCK/GPIO13_Minip: J4.13 ; port SCK/GPIO13_Minip  [project net MISO/IO11_MicroP]
SCL/GPIO17_Minip: J4.17 ; port SCL/GPIO17_Minip  [project net LM75_SCL]
SDA/GPIO19_Minip: J4.19 ; port SDA/GPIO19_Minip  [project net LM75_SDA]
TXD/GPIO10_Minip: J4.10 ; port TXD/GPIO10_Minip  [project net PA10/UART_RX/I2C_SDA]

### Notes on the sheet
- TXD
- RXD
- 3.3V
  GND
  PA0
  PA15
  PB3
  PA13
  PB4
  PB5
  PA11
  PA12
- 5V
  GND
  PA1
  PA8
  PA10
  PA9
  PA14
  PB6
  PB7
  NC
- 1
- #
- 修改日期
- 修改内容
- 2
- 3
- 设计人员
- 审核人员
- 设计日期
- 审核日期
- 产品名称
- 图纸名称
- 产品型号
- 图纸描述
- 图纸版本
- A4

## Sheet 04.Microport_Host.SchDoc
size A4; CheckedBy: <审核日期>; Author: 刘时杰; CompanyName: 广州致远电子有限公司; DocumentNumber: 4; SheetNumber: 4; SheetTotal: 8; PageSetup: Record=PageOptions|CenterHorizontal=True|CenterVertical=True|PrintScale=1.00|XCorrection=1.00|YCorrection=1.00|PrintKind=0|BorderSize=5000000|LeftOffset=0|BottomOffset=0|Orientation=2|PaperLength=1000|PaperWidth=1000|Scale=100|PaperSource=7|PrintQuality=600|MediaType=1|DitherType=10|PaperKind=A4|PrintScaleMode=1; DesignDate: 20180913; CheckDate: <审核人员>; SheetName: MicroPort接口; SheetVersion: V1.01; SheetDescription: MicroPort接口; productModel: AML166-Core; productName: AML166评估板
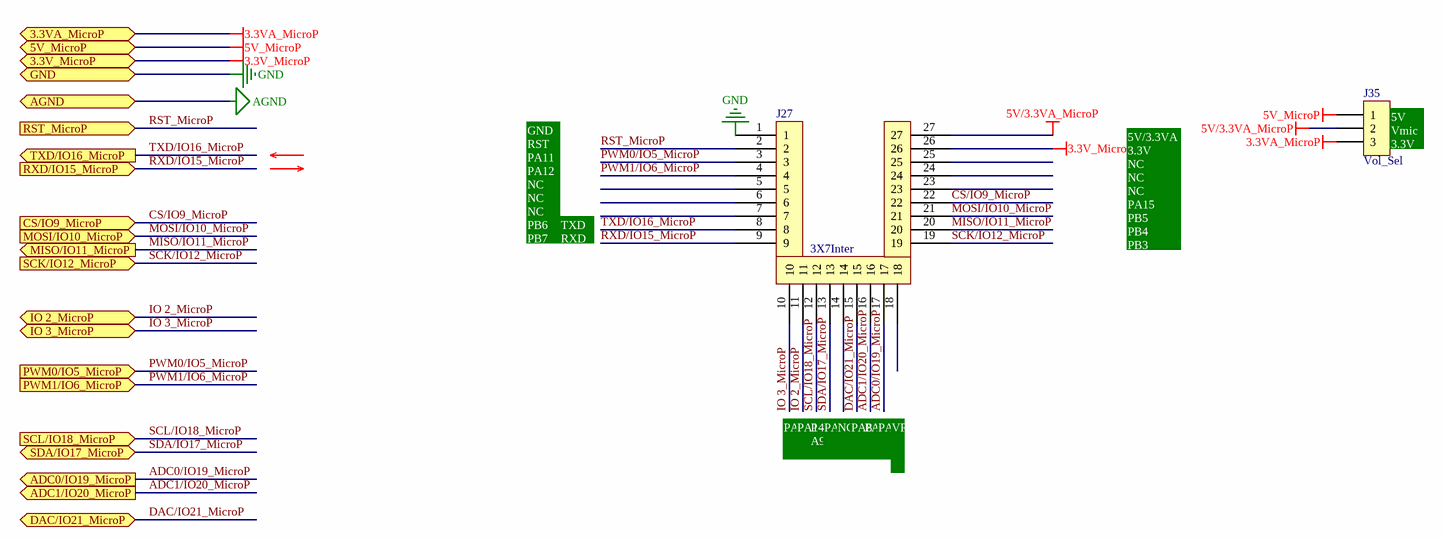
[diagram p3: 04.Microport_Host.SchDoc]

### Parts
J27  3X7Inter  [SIP-27 2.54C]
J35  Vol_Sel  [SIP-3-2.54]

### Ports
3.3V_MicroP, 3.3VA_MicroP, 5V_MicroP, ADC0/IO19_MicroP (out), ADC1/IO20_MicroP (out), AGND, CS/IO9_MicroP (in), DAC/IO21_MicroP (bidir), GND, IO 2_MicroP (bidir), IO 3_MicroP (bidir), MISO/IO11_MicroP (out), MOSI/IO10_MicroP (in), PWM0/IO5_MicroP (in), PWM1/IO6_MicroP (in), RST_MicroP (in), RXD/IO15_MicroP (in), SCK/IO12_MicroP (in), SCL/IO18_MicroP (in), SDA/IO17_MicroP (bidir), TXD/IO16_MicroP (out)

### Nets
3.3V_MicroP: J27.26 ; port 3.3V_MicroP  [project net 3.3V]
3.3VA_MicroP: J35.3 ; port 3.3VA_MicroP  [project net 3.3V_6219]
5V/3.3VA_MicroP: J27.27 J35.2
5V_MicroP: J35.1 ; port 5V_MicroP  [project net 5V]
AGND: J27.1 ; port GND, port AGND  [also labelled GND]
ADC0/IO19_MicroP: J27.17 ; port ADC0/IO19_MicroP
ADC1/IO20_MicroP: J27.16 ; port ADC1/IO20_MicroP
CS/IO9_MicroP: J27.22 ; port CS/IO9_MicroP  [project net CS/GPIO7_Minip]
DAC/IO21_MicroP: J27.15 ; port DAC/IO21_MicroP
IO 2_MicroP: J27.11 ; port IO 2_MicroP  [project net GPIO14_Minip]
IO 3_MicroP: J27.10 ; port IO 3_MicroP  [project net GPIO11_Minip]
MISO/IO11_MicroP: J27.20 ; port MISO/IO11_MicroP
MOSI/IO10_MicroP: J27.21 ; port MOSI/IO10_MicroP  [project net MOSI/GPIO15_Minip]
PWM0/IO5_MicroP: J27.3 ; port PWM0/IO5_MicroP  [project net LM75_SCL]
PWM1/IO6_MicroP: J27.4 ; port PWM1/IO6_MicroP  [project net LM75_SDA]
RST_MicroP: J27.2 ; port RST_MicroP  [project net ~{RESET}]
RXD/IO15_MicroP: J27.9 ; port RXD/IO15_MicroP  [project net GPIO18_Minip]
SCK/IO12_MicroP: J27.19 ; port SCK/IO12_MicroP  [project net MISO/GPIO9_Minip]
SCL/IO18_MicroP: J27.12 ; port SCL/IO18_MicroP  [project net PA9/UART_TX/I2C_SCL]
SDA/IO17_MicroP: J27.13 ; port SDA/IO17_MicroP  [project net PA10/UART_RX/I2C_SDA]
TXD/IO16_MicroP: J27.8 ; port TXD/IO16_MicroP  [project net GPIO16_Minip]

Not connected (* = marked no-connect by the designer): J27 5 6 7 14 18 23 24 25

### Notes on the sheet
- (near J35) 5V
- (near J35) Vmic
  3.3V
- GND
  RST
  PA11
  PA12
  NC
  NC
  NC
  PB6
  PB7
- TXD
- RXD
- 5V/3.3VA
  3.3V
  NC
  NC
  NC
  PA15
  PB5
  PB4
  PB3
- PA13
- PA14
- P
  A9
- PA10
- NC
- PA8
- PA0
- PA1
- VREF
- 1
- #
- 修改日期
- 修改内容
- 2
- 3
- 设计人员
- 审核人员
- 设计日期
- 审核日期
- 产品名称
- 图纸名称
- 产品型号
- 图纸描述
- 图纸版本
- A4

### Library data of the parts
J27 = 3X7Inter: 物料代码: 1.10.11.0074
J35 = CON3: Connector; 物料代码: 1.10.03.0164

## Sheet 03.板载外设 BEEP PNP.SchDoc
size A4; CheckedBy: <审核日期>; CompanyName: 广州致远电子有限公司; DocumentNumber: 3; SheetNumber: 3; SheetTotal: 8; PageSetup: Record=PageOptions|CenterHorizontal=True|CenterVertical=True|PrintScale=1.00|XCorrection=1.00|YCorrection=1.00|PrintKind=0|BorderSize=5000000|LeftOffset=0|BottomOffset=0|Orientation=2|PaperLength=1000|PaperWidth=1000|Scale=100|PaperSource=7|PrintQuality=600|MediaType=1|DitherType=10|PaperKind=A4|PrintScaleMode=1; DesignDate: 20180913; CheckDate: <审核人员>; SheetName: 评估板外设; SheetVersion: V1.01; SheetDescription: 评估板外设; productModel: AML166-Core; productName: AML166
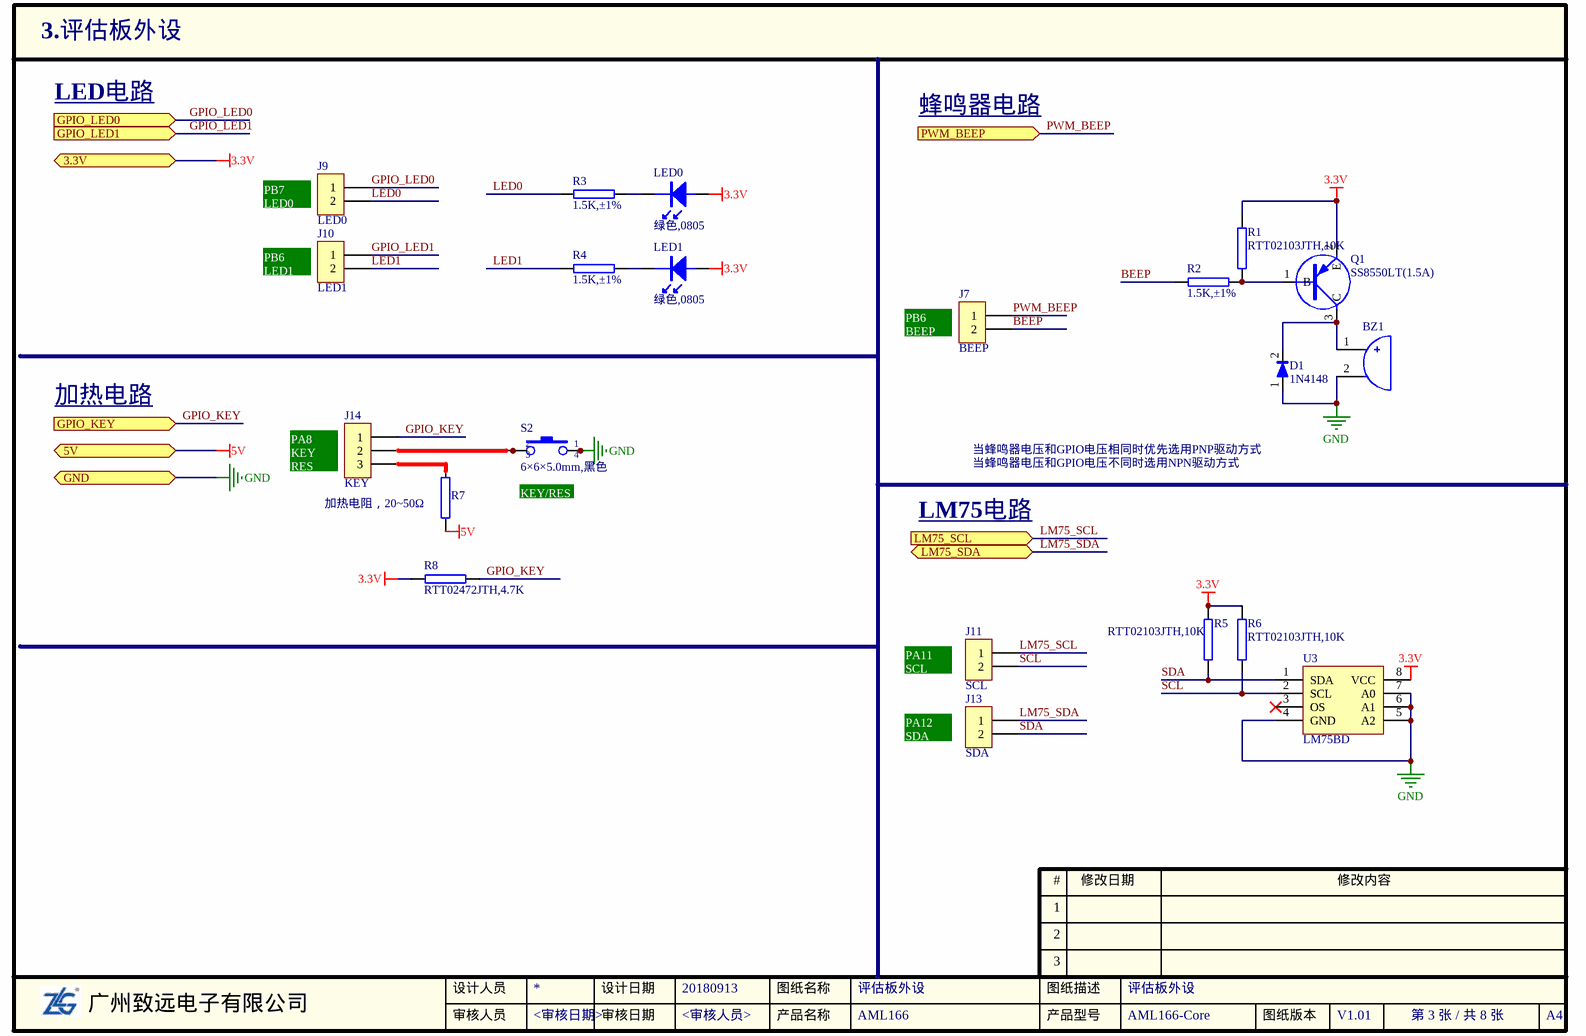
[diagram p4: 03.板载外设 BEEP PNP.SchDoc]

### Parts
BZ1  BUZZER2  [BUZZ-4/9]  (value not drawn)
D1  value 1N4148  [SOD-323]  (hidden comment: DIODE1)
J7  BEEP  [SIP-2-2.54]
J9  LED0  [SIP-2-2.54]
J10  LED1  [SIP-2-2.54]
J11  SCL  [SIP-2-2.54]
J13  SDA  [SIP-2-2.54]
J14  KEY  [SIP-3-2.54]
LED0  value 绿色,0805  [LED-0805]  (hidden comment: LED1)
LED1  value 绿色,0805  [LED-0805]  (hidden comment: LED1)
Q1  value SS8550LT(1.5A)  [SOT-23]  (hidden comment: PNP-1)
R1  RTT02103JTH,10K  [0402R]
R2  1.5K,±1%  [0402R]
R3  1.5K,±1%  [0402R]
R4  1.5K,±1%  [0402R]
R5  RTT02103JTH,10K  [0402R]
R6  RTT02103JTH,10K  [0402R]
R7  20Ω,±5%  [RESAD1778W80L1450D430P]  (value not drawn)
R8  RTT02472JTH,4.7K  [0402R]
S2  value 6×6×5.0mm,黑色  [KEY-6S]  (hidden comment: SW-PB4P)
U3  value LM75BD  [SOIC127P600X175-8N]  (hidden comment: LM75B)

### Ports
3.3V, 5V, GND, GPIO_KEY (in), GPIO_LED0 (in), GPIO_LED1 (in), LM75_SCL (in), LM75_SDA (bidir), PWM_BEEP (in)

### Nets
3.3V: LED0.1 LED1.1 Q1.2(E) R1.2 R5.2 R6.2 R8.1 U3.8(VCC) ; port 3.3V
5V: R7.1 ; port 5V
GND: BZ1.2(B) D1.1 S2.1 S2.4 U3.4(GND) U3.5(A2) U3.6(A1) U3.7(A0) ; port GND  [project net AGND]
BEEP: J7.2 R2.1
GPIO_KEY: J14.1 R8.2 ; port GPIO_KEY  [project net DAC/IO21_MicroP]
GPIO_LED0: J9.1 ; port GPIO_LED0  [project net GPIO18_Minip]
GPIO_LED1: J7.1 J10.1 ; port GPIO_LED1, port PWM_BEEP  [also labelled PWM_BEEP]  [project net GPIO16_Minip]
LED0: J9.2 R3.2
LED1: J10.2 R4.2
LM75_SCL: J11.1 ; port LM75_SCL
LM75_SDA: J13.1 ; port LM75_SDA
SCL: J11.2 R6.1 U3.2(SCL)
SDA: J13.2 R5.1 U3.1(SDA)
NetBZ1_1: BZ1.1(A) D1.2 Q1.3(C)
NetJ14_2: J14.2 S2.2 S2.3
NetJ14_3: J14.3 R7.2
NetLED0_2: LED0.2 R3.1
NetLED1_2: LED1.2 R4.1
NetQ1_1: Q1.1(B) R1.1 R2.2

Not connected (* = marked no-connect by the designer): U3 3(OS)*

### Notes on the sheet
- LED电路
- 蜂鸣器电路
- (near J9) PB7
  LED0
- (near J10) PB6
  LED1
- (near J7) PB6
  BEEP
- 加热电路
- (near J14) PA8
  KEY
  RES
- 加热电阻，20~50Ω
- (near S2) KEY/RES
- LM75电路
- 当蜂鸣器电压和GPIO电压相同时优先选用PNP驱动方式
- 当蜂鸣器电压和GPIO电压不同时选用NPN驱动方式
- PA11
  SCL
- PA12
  SDA
- 1
- #
- 修改日期
- 修改内容
- 2
- 3
- 设计人员
- 审核人员
- 设计日期
- 审核日期
- 产品名称
- 图纸名称
- 产品型号
- 图纸描述
- 图纸版本
- A4

### Library data of the parts
BZ1 = 1.06.09.0016: Buzzer有极性; Value: AS-905I-LF,无源; 名称: 讯响器; 厂商: 常州笠翔; 型号: AS-905I-LF,无源,Ф9×4.8mm; 贴片和直插: THT; PCB备注: Flq-Shcj-Twrj-150113; 器件优选方案: 量产物料,优先选用; 物料代码: 1.06.09.0016; RoHS: RoHS; ComponentLink1Description: ErpDataInfo; ComponentLink1URL: http://erp.zlgmcu.com/ErpExt/ErpData/ListMateriel.aspx?pkey=1.06.09.0016
D1 = 1.04.07.0027: 1N4148,SOD-323,RoHS; 名称: 二极管; 设备封装名称: SOD-323_1N4148; 贴片和直插: SMT; 物料代码: 1.04.07.0027; 封装: SOD-323; RoHS: RoHS; 型号: 1N4148; ComponentLink1Description: ErpDataInfo; ComponentLink1URL: http://erp.zlgmcu.com/ErpExt/ErpData/ListMateriel.aspx?pkey=1.04.07.0027
J7 J9-J11 J13 = CON2: Connector; 物料代码: 1.10.03.0164
J14 = CON3: Connector; 物料代码: 1.10.03.0164
LED0 LED1 = 1.04.05.0002: 绿色,0805,0805,RoHS; 名称: 发光二极管; 封装: 0805; 设备封装名称: LED0805-GREEN; 贴片和直插: SMT; 器件优选方案: 样品物料,谨慎选用; 物料代码: 1.04.05.0002; RoHS: RoHS; 型号: 绿色,0805; ComponentLink1Description: ErpDataInfo; ComponentLink1URL: http://erp.zlgmcu.com/ErpExt/ErpData/ListMateriel.aspx?pkey=1.04.05.0002
Q1 = 1.04.09.0002: PNP Transistor; 名称: 三极管; 设备封装名称: SOT-23_SS8550LT; 厂商: 江苏长电; 贴片和直插: SMT; 物料代码: 1.04.09.0002; 封装: SOT-23; RoHS: RoHS; 型号: SS8550LT(1.5A); ComponentLink1Description: ErpDataInfo; ComponentLink1URL: http://erp.zlgmcu.com/ErpExt/ErpData/ListMateriel.aspx?pkey=1.04.09.0002
R1 R5 R6 = 1.01.17.0006: as R11 on sheet 08.AML166; 物料代码: 1.01.17.0006; Value: RTT02103JTH,10K; 厂商: RALEC; RoHS: RoHS; 型号: RTT02103JTH,10K,±5%; ComponentLink1Description: ErpDataInfo; ComponentLink1URL: http://erp.zlgmcu.com/ErpExt/ErpData/ListMateriel.aspx?pkey=1.01.17.0006
R2-R4 = 1.01.17.0011: 1.5K,±1%,0402,RALEC,RoHS; 名称: 电阻; 封装: 0402; 设备封装名称: R0402_1.5K_1%; 贴片和直插: SMT; 器件优选方案: 正常状态，可以选用; 物料代码: 1.01.17.0011; Value: 1.5K,±1%; 厂商: Ralec; RoHS: RoHS; 型号: 1.5K,±1%; ComponentLink1Description: ErpDataInfo; ComponentLink1URL: http://erp.zlgmcu.com/ErpExt/ErpData/ListMateriel.aspx?pkey=1.01.17.0011
R7 = 1.01.10.0003: 20Ω,±5%,2W,Ф5.5×16mm,RoHS; 名称: 电阻; 贴片和直插: THT; 物料代码: 1.01.10.0003; Value: 20Ω,±5%; RoHS: RoHS; 型号: 20Ω,±5%,2W,Ф5.5×16mm; ComponentLink1Description: ErpDataInfo; ComponentLink1URL: http://erp.zlgmcu.com/ErpExt/ErpData/ListMateriel.aspx?pkey=1.01.10.0003
R8 = 1.01.17.0019: RTT02472JTH,4.7K,±5%,0402,RALEC,RoHS; 名称: 电阻; 封装: 0402; 设备封装名称: R0402_4.7K; 贴片和直插: SMT; 器件优选方案: 正常状态，可以选用; 物料代码: 1.01.17.0019; Value: RTT02472JTH,4.7K; 厂商: RALEC; RoHS: RoHS; 型号: RTT02472JTH,4.7K,±5%; ComponentLink1Description: ErpDataInfo; ComponentLink1URL: http://erp.zlgmcu.com/ErpExt/ErpData/ListMateriel.aspx?pkey=1.01.17.0019
S2 = 1.09.01.0003: as S4 on sheet 08.AML166; 物料代码: 1.09.01.0003; 型号: 6×6×5.0mm,黑色,SMD; ComponentLink1Description: ErpDataInfo; ComponentLink1URL: http://erp.zlgmcu.com/ErpExt/ErpData/ListMateriel.aspx?pkey=1.09.01.0003
U3 = 1.05.10.0602: LM75BD,SO-9,NXP,RoHS; 名称: IC; 封装: SO-8; 贴片和直插: SMT; 器件优选方案: 样品物料,谨慎选用; 物料代码: 1.05.10.0602; 厂商: NXP; RoHS: RoHS; 型号: LM75BD; ComponentLink1Description: ErpDataInfo; ComponentLink1URL: http://erp.zlgmcu.com/ErpExt/ErpData/ListMateriel.aspx?pkey=1.05.10.0602

## Sheet 02.Power.SchDoc
size A4; Author: 刘时杰; CompanyName: 广州致远电子有限公司; DocumentNumber: 2; SheetNumber: 2; SheetTotal: 8; PageSetup: Record=PageOptions|CenterHorizontal=True|CenterVertical=True|PrintScale=1.00|XCorrection=1.00|YCorrection=1.00|PrintKind=0|BorderSize=5000000|LeftOffset=0|BottomOffset=0|Orientation=2|PaperLength=1000|PaperWidth=1000|Scale=100|PaperSource=7|PrintQuality=600|MediaType=1|DitherType=10|PaperKind=A4|PrintScaleMode=1; DesignDate: 20180913; CheckDate: 20180913; SheetName: POWER; SheetVersion: V1.00; SheetDescription: AML166评估板电源电路
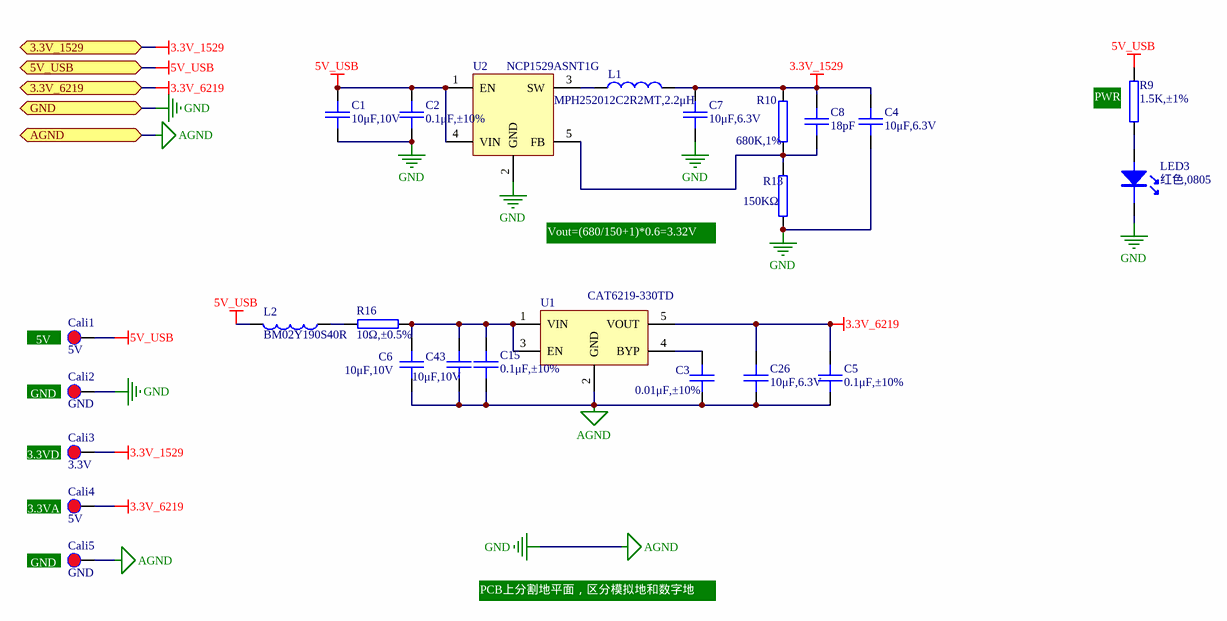
[diagram p5: 02.Power.SchDoc]

### Parts
C1  10μF,10V  [0805C]
C2  0.1μF,±10%  [0402C]
C3  0.01μF,±10%  [0402C]
C4  10μF,6.3V  [0603C]
C5  0.1μF,±10%  [0402C]
C6  10μF,10V  [0805C]
C7  10μF,6.3V  [0603C]
C8  18pF  [0402C]
C15  0.1μF,±10%  [0402C]
C26  10μF,6.3V  [0603C]
C43  10μF,10V  [0805C]
Cali1  5V  [PAD-25/40]  (no BOM)
Cali2  GND  [PAD-25/40]  (no BOM)
Cali3  3.3V  [PAD-25/40]  (no BOM)
Cali4  5V  [PAD-25/40]  (no BOM)
Cali5  GND  [PAD-25/40]  (no BOM)
L1  MPH252012C2R2MT,2.2μH  [INDC2520X10N]
L2  BM02Y190S40R  [0402RL]
LED3  value 红色,0805  [LED-0805]  (hidden comment: LED1)
R9  1.5K,±1%  [0402R]
R10  680K,1%  [0402R]
R13  150KΩ  [0603R]
R16  10Ω,±0.5%  [0402R]
U1  CAT6219-330TD  [SOT-23-5]
U2  NCP1529ASNT1G  [SOT-23-5]

### Ports
3.3V_1529, 3.3V_6219, 5V_USB, AGND, GND

### Nets
3.3V_1529: C4.1 C7.1 C8.1 Cali3.1 L1.2 R10.2 ; port 3.3V_1529  [project net 3.3V]
3.3V_6219: C5.1 C26.1 Cali4.1 U1.5(VOUT) ; port 3.3V_6219
5V_USB: C1.1 C2.1 Cali1.1 L2.2 R9.2 U2.1(EN) U2.4(VIN) ; port 5V_USB  [project net 5V]
AGND: C1.2 C2.2 C3.2 C4.2 C5.2 C6.2 C7.2 C15.2 C26.2 C43.2 Cali2.1 Cali5.1 LED3.2 R13.1 U1.2(GND) U2.2(GND) ; port GND, port AGND  [also labelled GND]
NetC3_1: C3.1 U1.4(BYP)
NetC6_1: C6.1 C15.1 C43.1 R16.2 U1.1(VIN) U1.3(EN)
NetC8_2: C8.2 R10.1 R13.2 U2.5(FB)
NetL1_1: L1.1 U2.3(SW)
NetL2_1: L2.1 R16.1
NetLED3_1: LED3.1 R9.1

### Notes on the sheet
- (near R9) PWR
- Vout=(680/150+1)*0.6=3.32V
- (near Cali1) 5V
- (near Cali2) GND
- (near Cali3) 3.3VD
- (near Cali4) 3.3VA
- (near Cali5) GND
- PCB上分割地平面，区分模拟地和数字地
- 1
- #
- 修改日期
- 修改内容
- 2
- 3
- 设计人员
- 审核人员
- 设计日期
- 审核日期
- 产品名称
- 图纸名称
- 产品型号
- 图纸描述
- 图纸版本
- A4

### Library data of the parts
C1 C6 C43 = 1.02.02.0117: 10μF,±10%,10V,X7R,GRM21BR71A106KE51L,0805,muRata,RoHS; 名称: 电容; 封装: 0805; 贴片和直插: SMT; PCB备注: 171017lmd; 器件优选方案: 正常状态，可以选用; 物料代码: 1.02.02.0117; Value: 10μF,10V; 厂商: muRata; RoHS: RoHS; 型号: 10μF,±10%,10V,X7R,GRM21BR71A106KE51L; ComponentLink1Description: ErpDataInfo; ComponentLink1URL: http://erp.zlgmcu.com/ErpExt/ErpData/ListMateriel.aspx?pkey=1.02.02.0117
C2 C5 C15 = 1.02.17.0006: as C23 on sheet 08.AML166; 物料代码: 1.02.17.0006; Value: 0.1μF,±10%; 厂商: muRata; RoHS: RoHS; 型号: 0.1μF,±10%,16V,X7R; ComponentLink1Description: ErpDataInfo; ComponentLink1URL: http://erp.zlgmcu.com/ErpExt/ErpData/ListMateriel.aspx?pkey=1.02.17.0006
C3 = 1.02.17.0019: as C39 on sheet 08.AML166; 物料代码: 1.02.17.0019; Value: 0.01μF,±10%; 厂商: muRata; RoHS: RoHS; 型号: 0.01μF,±10%,50V,X7R; ComponentLink1Description: ErpDataInfo; ComponentLink1URL: http://erp.zlgmcu.com/ErpExt/ErpData/ListMateriel.aspx?pkey=1.02.17.0019
C4 C7 C26 = 1.02.01.0065: as C20 on sheet 08.AML166; 物料代码: 1.02.01.0065; Value: 10μF,6.3V; 厂商: muRata; RoHS: RoHS; 型号: 10μF,6.3V,X5R,GRM188R60J106M****; ComponentLink1Description: ErpDataInfo; ComponentLink1URL: http://erp.zlgmcu.com/ErpExt/ErpData/ListMateriel.aspx?pkey=1.02.01.0065
C8 = 1.02.17.0078: GRM1555C1H180JA01D,18pF,±5%,50V,C0G,0402,muRata,RoHS; 名称: 电容; 封装: 0402; 贴片和直插: SMT; 器件优选方案: 正常状态，可以选用; 物料代码: 1.02.17.0078; Value: 18pF; 厂商: muRata; RoHS: RoHS; 型号: GRM1555C1H180JA01D,18pF,±5%,50V,C0G; ComponentLink1Description: ErpDataInfo; ComponentLink1URL: http://erp.zlgmcu.com/ErpExt/ErpData/ListMateriel.aspx?pkey=1.02.17.0078
Cali1-Cali5 = TEST-DOT
L1 = 1.03.01.0347: MPH252012C2R2MT,2.2μH,±20%,700mA,1008,Sunlord,RoHs; 名称: 电感; 封装: 1008; 贴片和直插: SMT; PCB备注: 160722ZW   160729toPCB-hcj; 器件优选方案: 正常状态，可以选用; 物料代码: 1.03.01.0347; Value: MPH252012C2R2MT,2.2μH; 厂商: Sunlord; RoHS: RoHS; 型号: MPH252012C2R2MT,2.2μH,±20%,700mA; ComponentLink1Description: ErpDataInfo; ComponentLink1URL: http://erp.zlgmcu.com/ErpExt/ErpData/ListMateriel.aspx?pkey=1.03.01.0347
L2 = 1.03.03.0022: BM02Y190S40R,0402,丰晶,RoHS; 名称: 磁珠; 封装: 0402; 贴片和直插: SMT; 器件优选方案: 正常状态，可以选用; 物料代码: 1.03.03.0022; Value: BM02Y190S40R; 厂商: 丰晶; RoHS: RoHS; 型号: BM02Y190S40R; ComponentLink1Description: ErpDataInfo; ComponentLink1URL: http://erp.zlgmcu.com/ErpExt/ErpData/ListMateriel.aspx?pkey=1.03.03.0022
LED3 = 1.04.05.0001: 红色,0805,0805,RoHS; 名称: 发光二极管; 封装: 0805; 设备封装名称: LED0805-RED; 贴片和直插: SMT; 器件优选方案: 样品物料,谨慎选用; 物料代码: 1.04.05.0001; RoHS: RoHS; 型号: 红色,0805; ComponentLink1Description: ErpDataInfo; ComponentLink1URL: http://erp.zlgmcu.com/ErpExt/ErpData/ListMateriel.aspx?pkey=1.04.05.0001
R9 = 1.01.17.0011: as R2 on sheet 03.板载外设 BEEP PNP; 物料代码: 1.01.17.0011; Value: 1.5K,±1%; 厂商: Ralec; RoHS: RoHS; 型号: 1.5K,±1%; ComponentLink1Description: ErpDataInfo; ComponentLink1URL: http://erp.zlgmcu.com/ErpExt/ErpData/ListMateriel.aspx?pkey=1.01.17.0011
R10 = 1.01.17.0086: 680K,1%,0402,Ralec,RoHS; 名称: 电阻; 封装: 0402; 贴片和直插: SMT; 器件优选方案: 正常状态，可以选用; 物料代码: 1.01.17.0086; Value: 680K,1%; 厂商: Ralec; RoHS: RoHS; 型号: 680K,1%; ComponentLink1Description: ErpDataInfo; ComponentLink1URL: http://erp.zlgmcu.com/ErpExt/ErpData/ListMateriel.aspx?pkey=1.01.17.0086
R13 = 1.01.01.0065: 150KΩ,0603,*,RoHS; 名称: 电阻; 封装: 0603; 设备封装名称: R0603_150K; 厂商: Ralec; 贴片和直插: SMT; 器件优选方案: 正常状态，可以选用; 物料代码: 1.01.01.0065; Value: 150KΩ; RoHS: RoHS; 型号: 150KΩ; ComponentLink1Description: ErpDataInfo; ComponentLink1URL: http://erp.zlgmcu.com/ErpExt/ErpData/ListMateriel.aspx?pkey=1.01.01.0065
R16 = 1.01.17.0049: 10Ω,±0.5%,0402,RoHS; 名称: 电阻; 封装: 0402; 设备封装名称: R0402_10R_0.5%; 厂商: Ralec; 贴片和直插: SMT; 器件优选方案: 正常状态，可以选用; 物料代码: 1.01.17.0049; Value: 10Ω,±0.5%; RoHS: RoHS; 型号: 10Ω,±0.5%; ComponentLink1Description: ErpDataInfo; ComponentLink1URL: http://erp.zlgmcu.com/ErpExt/ErpData/ListMateriel.aspx?pkey=1.01.17.0049
U1 = 1.05.10.0321: CAT6219-330TD,TSOT-23-5,ON,RoHS; 名称: 集成电路; 设备封装名称: TSOT-23-5_CAT6219-330TD-GT3; 贴片和直插: SMT; 器件优选方案: 量产物料,优先选用; 物料代码: 1.05.10.0321; Value: CAT6219-330TD; 封装: TSOT-23-5; 厂商: ON; RoHS: RoHS; 型号: CAT6219-330TD; ComponentLink1Description: ErpDataInfo; ComponentLink1URL: http://erp.zlgmcu.com/ErpExt/ErpData/ListMateriel.aspx?pkey=1.05.10.0321
U2 = 1.05.09.0091: NCP1529ASNT1G,TSOP-5,ON,RoHS; 名称: 集成电路; 设备封装名称: TSOP-5_NCP1529ASNT1G; 贴片和直插: SMT; 器件优选方案: 量产物料,优先选用; 物料代码: 1.05.09.0091; Value: NCP1529ASNT1G; 封装: TSOP-5; 厂商: ON; RoHS: RoHS; 型号: NCP1529ASNT1G; ComponentLink1Description: ErpDataInfo; ComponentLink1URL: http://erp.zlgmcu.com/ErpExt/ErpData/ListMateriel.aspx?pkey=1.05.09.0091

## Sheet 09.RST_WDT_CAT823.SchDoc
size A4; CompanyName: 广州致远电子有限公司; DocumentNumber: 8; SheetNumber: 8; SheetTotal: 8; PageSetup: Record=PageOptions|CenterHorizontal=True|CenterVertical=True|PrintScale=1.00|XCorrection=1.00|YCorrection=1.00|PrintKind=0|BorderSize=5000000|LeftOffset=0|BottomOffset=0|Orientation=2|PaperLength=1000|PaperWidth=1000|Scale=100|PaperSource=7|PrintQuality=600|MediaType=1|DitherType=10|PaperKind=A4|PrintScaleMode=1; DesignDate: 2015-07-29; CheckDate: 2015-07-29; SheetName: CAT823; SheetVersion: V1.00; SheetDescription: CAT823
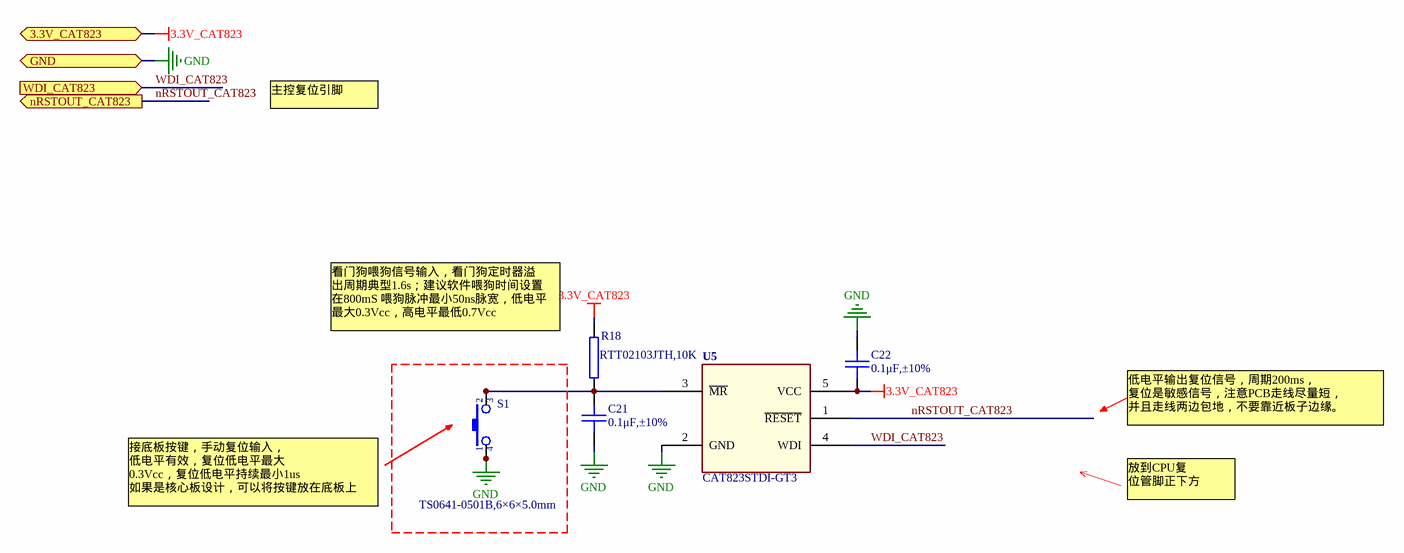
[diagram p6: 09.RST_WDT_CAT823.SchDoc]

### Parts
C21  0.1μF,±10%  [0402C]
C22  0.1μF,±10%  [0402C]
R18  RTT02103JTH,10K  [0402R]
S1  TS0641-0501B,6×6×5.0mm  [KEY-6S]
U5  CAT823STDI-GT3  [SOT-23-5]

### Ports
3.3V_CAT823, GND, nRSTOUT_CAT823 (out), WDI_CAT823 (in)

### Nets
3.3V_CAT823: C22.2 R18.1 U5.5(VCC) ; port 3.3V_CAT823  [project net 3.3V]
GND: C21.2 C22.1 S1.1 S1.4 U5.2(GND) ; port GND  [project net AGND]
nRSTOUT_CAT823: U5.1(~{RESET}) ; port nRSTOUT_CAT823  [project net nRST_WDT]
WDI_CAT823: U5.4(WDI) ; port WDI_CAT823  [project net ADC0/IO19_MicroP]
NetC21_1: C21.1 R18.2 S1.2 S1.3 U5.3(~{MR})

### Notes on the sheet
- 主控复位引脚
- (near R18) 看门狗喂狗信号输入，看门狗定时器溢
  出周期典型1.6s；建议软件喂狗时间设置
  在800mS 喂狗脉冲最小50ns脉宽，低电平
  最大0.3Vcc，高电平最低0.7Vcc
- 低电平输出复位信号，周期200ms，
  复位是敏感信号，注意PCB走线尽量短，
  并且走线两边包地，不要靠近板子边缘。
- 接底板按键，手动复位输入，
  低电平有效，复位低电平最大
  0.3Vcc，复位低电平持续最小1us
  如果是核心板设计，可以将按键放在底板上
- 放到CPU复
  位管脚正下方
- 1
- #
- 修改日期
- 修改内容
- 2
- 3
- 设计人员
- 审核人员
- 设计日期
- 审核日期
- 产品名称
- 图纸名称
- 产品型号
- 图纸描述
- 图纸版本
- A4

### Library data of the parts
C21 C22 = 1.02.17.0006: as C23 on sheet 08.AML166; 物料代码: 1.02.17.0006; Value: 0.1μF,±10%; 厂商: muRata; RoHS: RoHS; 型号: 0.1μF,±10%,16V,X7R; ComponentLink1Description: ErpDataInfo; ComponentLink1URL: http://erp.zlgmcu.com/ErpExt/ErpData/ListMateriel.aspx?pkey=1.02.17.0006
R18 = 1.01.17.0006: as R11 on sheet 08.AML166; 物料代码: 1.01.17.0006; Value: RTT02103JTH,10K; 厂商: RALEC; RoHS: RoHS; 型号: RTT02103JTH,10K,±5%; ComponentLink1Description: ErpDataInfo; ComponentLink1URL: http://erp.zlgmcu.com/ErpExt/ErpData/ListMateriel.aspx?pkey=1.01.17.0006
S1 = 1.09.01.0003: TS0641-0501B,6×6×5.0mm,黑色,SMD,卷带装,RoHS; 名称: 轻触开关; 贴片和直插: SMT; 器件优选方案: 正常状态，可以选用; 物料代码: 1.09.01.0003; Value: TS0641-0501B,6×6×5.0mm; 型号: TS0641-0501B,6×6×5.0mm,黑色,SMD,卷带装; ComponentLink1Description: ErpDataInfo; ComponentLink1URL: http://erp.zlgmcu.com/ErpExt/ErpData/ListMateriel.aspx?pkey=1.09.01.0003; RoHS: RoHS
U5 = CAT823: 1.05.07.0025; 物料代码: 1.05.07.0025

## Sheet 07.USB Device_MicroUSB_CON.SchDoc
size A4; CompanyName: 广州致远电子有限公司; DocumentNumber: 6; SheetNumber: 6; SheetTotal: 8; PageSetup: Record=PageOptions|CenterHorizontal=True|CenterVertical=True|PrintScale=1.00|XCorrection=1.00|YCorrection=1.00|PrintKind=0|BorderSize=5000000|LeftOffset=0|BottomOffset=0|Orientation=2|PaperLength=1000|PaperWidth=1000|Scale=100|PaperSource=7|PrintQuality=600|MediaType=1|DitherType=10|PaperKind=A4|PrintScaleMode=1; DesignDate: 20180913; SheetName: USB接口电路; SheetVersion: <图纸版本>; SheetDescription: USB接口电路，纯供电，没有usb信号
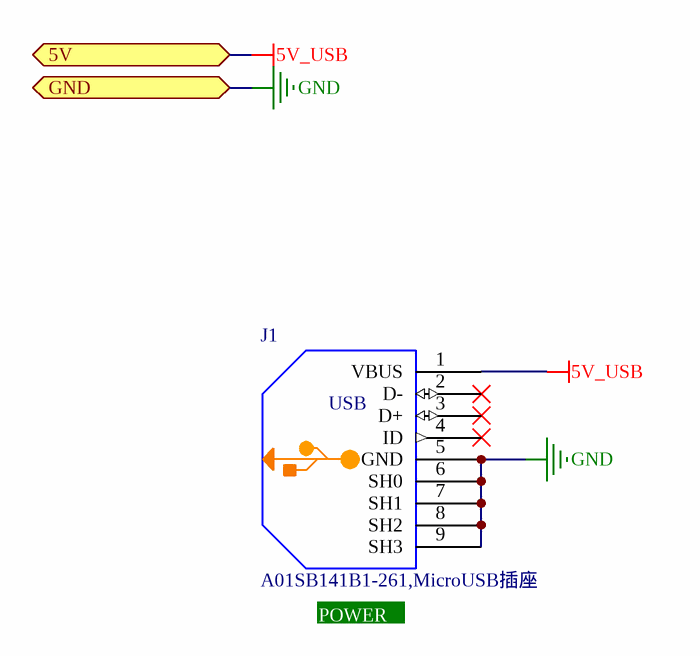
[diagram p7: 07.USB Device_MicroUSB_CON.SchDoc]

### Parts
J1  A01SB141B1-261,MicroUSB插座  [MICROUSB-5S]

### Ports
5V, GND

### Nets
5V_USB: J1.1(VBUS) ; port 5V  [project net 5V]
GND: J1.5(GND) J1.6(SH0) J1.7(SH1) J1.8(SH2) J1.9(SH3) ; port GND  [project net AGND]

Not connected (* = marked no-connect by the designer): J1 2(D-)* 3(D+)* 4(ID)*

### Notes on the sheet
- (near J1) POWER
- 1
- #
- 修改日期
- 修改内容
- 2
- 3
- 设计人员
- 审核人员
- 设计日期
- 审核日期
- 产品名称
- 图纸名称
- 产品型号
- 图纸描述
- 图纸版本
- A4
- (in symbol 1.10.12.0014) USB

### Library data of the parts
J1 = 1.10.12.0014: A01SB141B1-261,MicroUSB插座,SMT,艾立信,RoHS; PCB备注: 141030lmd; 器件优选方案: 正常状态，可以选用; 物料代码: 1.10.12.0014; Value: A01SB141B1-261,MicroUSB插座; 名称: MicroUSB插座; 封装: SMT; 厂商: 艾立信; RoHS: RoHS; 型号: A01SB141B1-261,MicroUSB插座; 贴片和直插: SMT; ComponentLink1Description: ErpDataInfo; ComponentLink1URL: http://erp.zlgmcu.com/ErpExt/ErpData/ListMateriel.aspx?pkey=1.10.12.0014

## Nets that join several sheets
3.3V: 08.AML166 (10 pins), 05.Miniport_Host (J4.1), 04.Microport_Host (J27.26), 03.板载外设 BEEP PNP (8 pins), 02.Power (6 pins), 09.RST_WDT_CAT823 (C22.2 R18.1 U5.5)
3.3V_6219: 08.AML166 (12 pins), 04.Microport_Host (J35.3), 02.Power (C5.1 C26.1 Cali4.1 U1.5)
5V: 05.Miniport_Host (J4.2), 04.Microport_Host (J35.1), 03.板载外设 BEEP PNP (R7.1), 02.Power (7 pins), 07.USB Device_MicroUSB_CON (J1.1)
AGND: 01.mian (J26.1), 08.AML166 (43 pins), 05.Miniport_Host (J4.3 J4.4), 04.Microport_Host (J27.1), 03.板载外设 BEEP PNP (8 pins), 02.Power (16 pins), 09.RST_WDT_CAT823 (5 pins), 07.USB Device_MicroUSB_CON (5 pins)
ADC0/IO19_MicroP: 08.AML166 (U6.9), 05.Miniport_Host (J4.6), 04.Microport_Host (J27.17), 09.RST_WDT_CAT823 (U5.4)
ADC1/IO20_MicroP: 08.AML166 (U6.8), 05.Miniport_Host (J4.5), 04.Microport_Host (J27.16)
ADC1_0: 01.mian (J15.1), 08.AML166 (R14.1)
ADC1_1: 01.mian (J15.2), 08.AML166 (R17.1)
CS/GPIO7_Minip: 08.AML166 (U6.26), 05.Miniport_Host (J4.7), 04.Microport_Host (J27.22)
DAC/IO21_MicroP: 08.AML166 (U6.18), 05.Miniport_Host (J4.8), 04.Microport_Host (J27.15), 03.板载外设 BEEP PNP (J14.1 R8.2)
GPIO11_Minip: 08.AML166 (J2.2 R11.1 U6.23), 05.Miniport_Host (J4.11), 04.Microport_Host (J27.10)
GPIO14_Minip: 08.AML166 (J2.3 R12.2 U6.25), 05.Miniport_Host (J4.14), 04.Microport_Host (J27.11)
GPIO16_Minip: 08.AML166 (U6.30), 05.Miniport_Host (J4.16), 04.Microport_Host (J27.8), 03.板载外设 BEEP PNP (J7.1 J10.1)
GPIO18_Minip: 08.AML166 (U6.31), 05.Miniport_Host (J4.18), 04.Microport_Host (J27.9), 03.板载外设 BEEP PNP (J9.1)
LM75_SCL: 08.AML166 (U6.21), 05.Miniport_Host (J4.17), 04.Microport_Host (J27.3), 03.板载外设 BEEP PNP (J11.1)
LM75_SDA: 08.AML166 (U6.22), 05.Miniport_Host (J4.19), 04.Microport_Host (J27.4), 03.板载外设 BEEP PNP (J13.1)
MISO/GPIO9_Minip: 08.AML166 (U6.27), 05.Miniport_Host (J4.9), 04.Microport_Host (J27.19)
MISO/IO11_MicroP: 08.AML166 (U6.28), 05.Miniport_Host (J4.13), 04.Microport_Host (J27.20)
MOSI/GPIO15_Minip: 08.AML166 (U6.29), 05.Miniport_Host (J4.15), 04.Microport_Host (J27.21)
nRST_WDT: 08.AML166 (J8.1), 09.RST_WDT_CAT823 (U5.1)
PA9/UART_TX/I2C_SCL: 08.AML166 (U6.19), 05.Miniport_Host (J4.12), 04.Microport_Host (J27.12)
PA10/UART_RX/I2C_SDA: 08.AML166 (U6.20), 05.Miniport_Host (J4.10), 04.Microport_Host (J27.13)
~{RESET}: 08.AML166 (5 pins), 04.Microport_Host (J27.2)
RTD_A: 01.mian (J6.3), 08.AML166 (J5.3 R25.2)
RTD_B: 01.mian (J6.2), 08.AML166 (J12.3)
RTD_C: 01.mian (J6.1), 08.AML166 (J17.3 R24.1 R30.1 R49.2)
TC_A: 01.mian (J3.2), 08.AML166 (J5.1 R20.1)
TC_B: 01.mian (J3.1), 08.AML166 (J17.1 R43.1 R44.1)
VLDO: 01.mian (J26.2), 08.AML166 (C20.1 R22.2 U6.10)